# EAGLE design Main board (EAGLE 9.6.2)

## Sheet 1 of 4
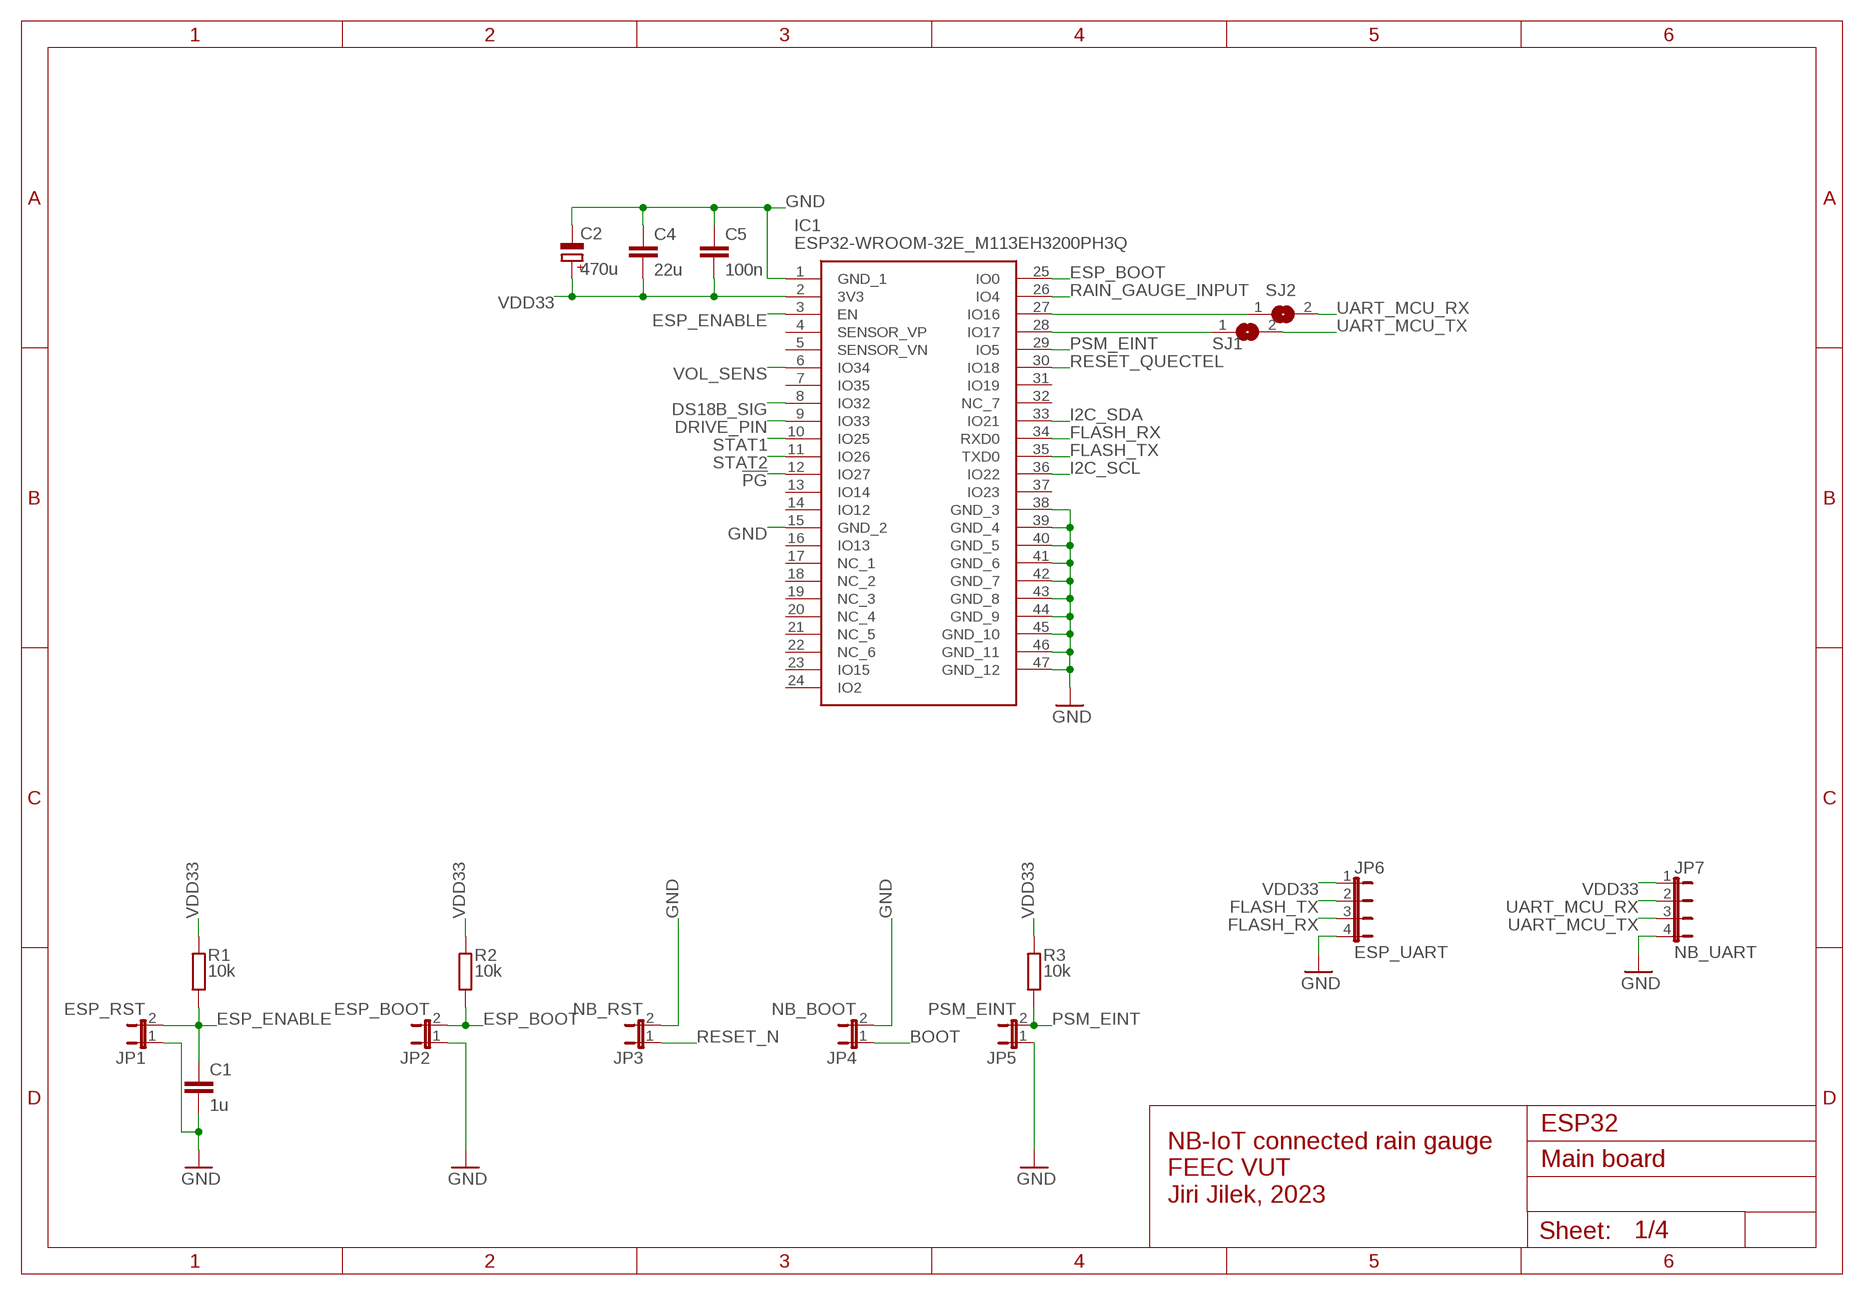
[diagram p0: schematic, sheet 1]

### Parts
C1  1u  C-EUC0603  [C0603]
C2  470u  CPOL-EUD  [PANASONIC_D]
C4  22u  C-EUC0603  [C0603]
C5  100n  C-EUC0603  [C0603]
IC1  ESP32-WROOM-32E_M113EH3200PH3Q  [ESP32WROOM32EM113EH3200PH3Q0]
JP1  ESP_RST  JP1E  [JP1]
JP2  ESP_BOOT  JP1E  [JP1]
JP3  NB_RST  JP1E  [JP1]
JP4  NB_BOOT  JP1E  [JP1]
JP5  PSM_EINT  JP1E  [JP1]
JP6  ESP_UART  JP4E  [JP4]
JP7  NB_UART  JP4E  [JP4]
R1  10k  R-EU_R0603  [R0603]
R2  10k  R-EU_R0603  [R0603]
R3  10k  R-EU_R0603  [R0603]
SJ1  SJ  [SJ]
SJ2  SJ  [SJ]

### Nets
!PG: IC1.12(IO27) ; also sheet 3
BOOT: JP4.1 ; also sheet 2
DRIVE_PIN: IC1.9(IO33) ; also sheet 4
DS18B_SIG: IC1.8(IO32) ; also sheet 4
ESP_BOOT: IC1.25(IO0) JP2.2 R2.1
ESP_ENABLE: C1.1 IC1.3(EN) JP1.2 R1.1
FLASH_RX: IC1.34(RXD0) JP6.3
FLASH_TX: IC1.35(TXD0) JP6.2
GND: C1.2 C2.- C4.1 C5.1 IC1.1(GND_1) IC1.15(GND_2) IC1.38(GND_3) IC1.39(GND_4) IC1.40(GND_5) IC1.41(GND_6) IC1.42(GND_7) IC1.43(GND_8) IC1.44(GND_9) IC1.45(GND_10) IC1.46(GND_11) IC1.47(GND_12) JP1.1 JP2.1 JP3.2 JP4.2 JP5.1 JP6.4 JP7.4 ; also sheet 2,3,4
I2C_SCL: IC1.36(IO22) ; also sheet 4
I2C_SDA: IC1.33(IO21) ; also sheet 4
N$3: IC1.27(IO16) SJ2.1
N$4: IC1.28(IO17) SJ1.1
PSM_EINT: IC1.29(IO5) JP5.2 R3.1 ; also sheet 2
RAIN_GAUGE_INPUT: IC1.26(IO4) ; also sheet 4
RESET_N: JP3.1 ; also sheet 2
RESET_QUECTEL: IC1.30(IO18) ; also sheet 2
STAT1: IC1.10(IO25) ; also sheet 3
STAT2: IC1.11(IO26) ; also sheet 3
UART_MCU_RX: JP7.2 SJ2.2 ; also sheet 2
UART_MCU_TX: JP7.3 SJ1.2 ; also sheet 2
VDD33: C2.+ C4.2 C5.2 IC1.2(3V3) JP6.1 JP7.1 R1.2 R2.2 R3.2 ; also sheet 2,3,4
VOL_SENS: IC1.6(IO34) ; also sheet 4
Unconnected: IC1.4(SENSOR_VP) IC1.5(SENSOR_VN) IC1.7(IO35) IC1.13(IO14) IC1.14(IO12) IC1.16(IO13) IC1.17(NC_1) IC1.18(NC_2) IC1.19(NC_3) IC1.20(NC_4) IC1.21(NC_5) IC1.22(NC_6) IC1.23(IO15) IC1.24(IO2) IC1.31(IO19) IC1.32(NC_7) IC1.37(IO23)

### Notes on the sheet
- NB-IoT connected rain gauge
  FEEC VUT
  Jiri Jilek, 2023
- ESP32

## Sheet 2 of 4
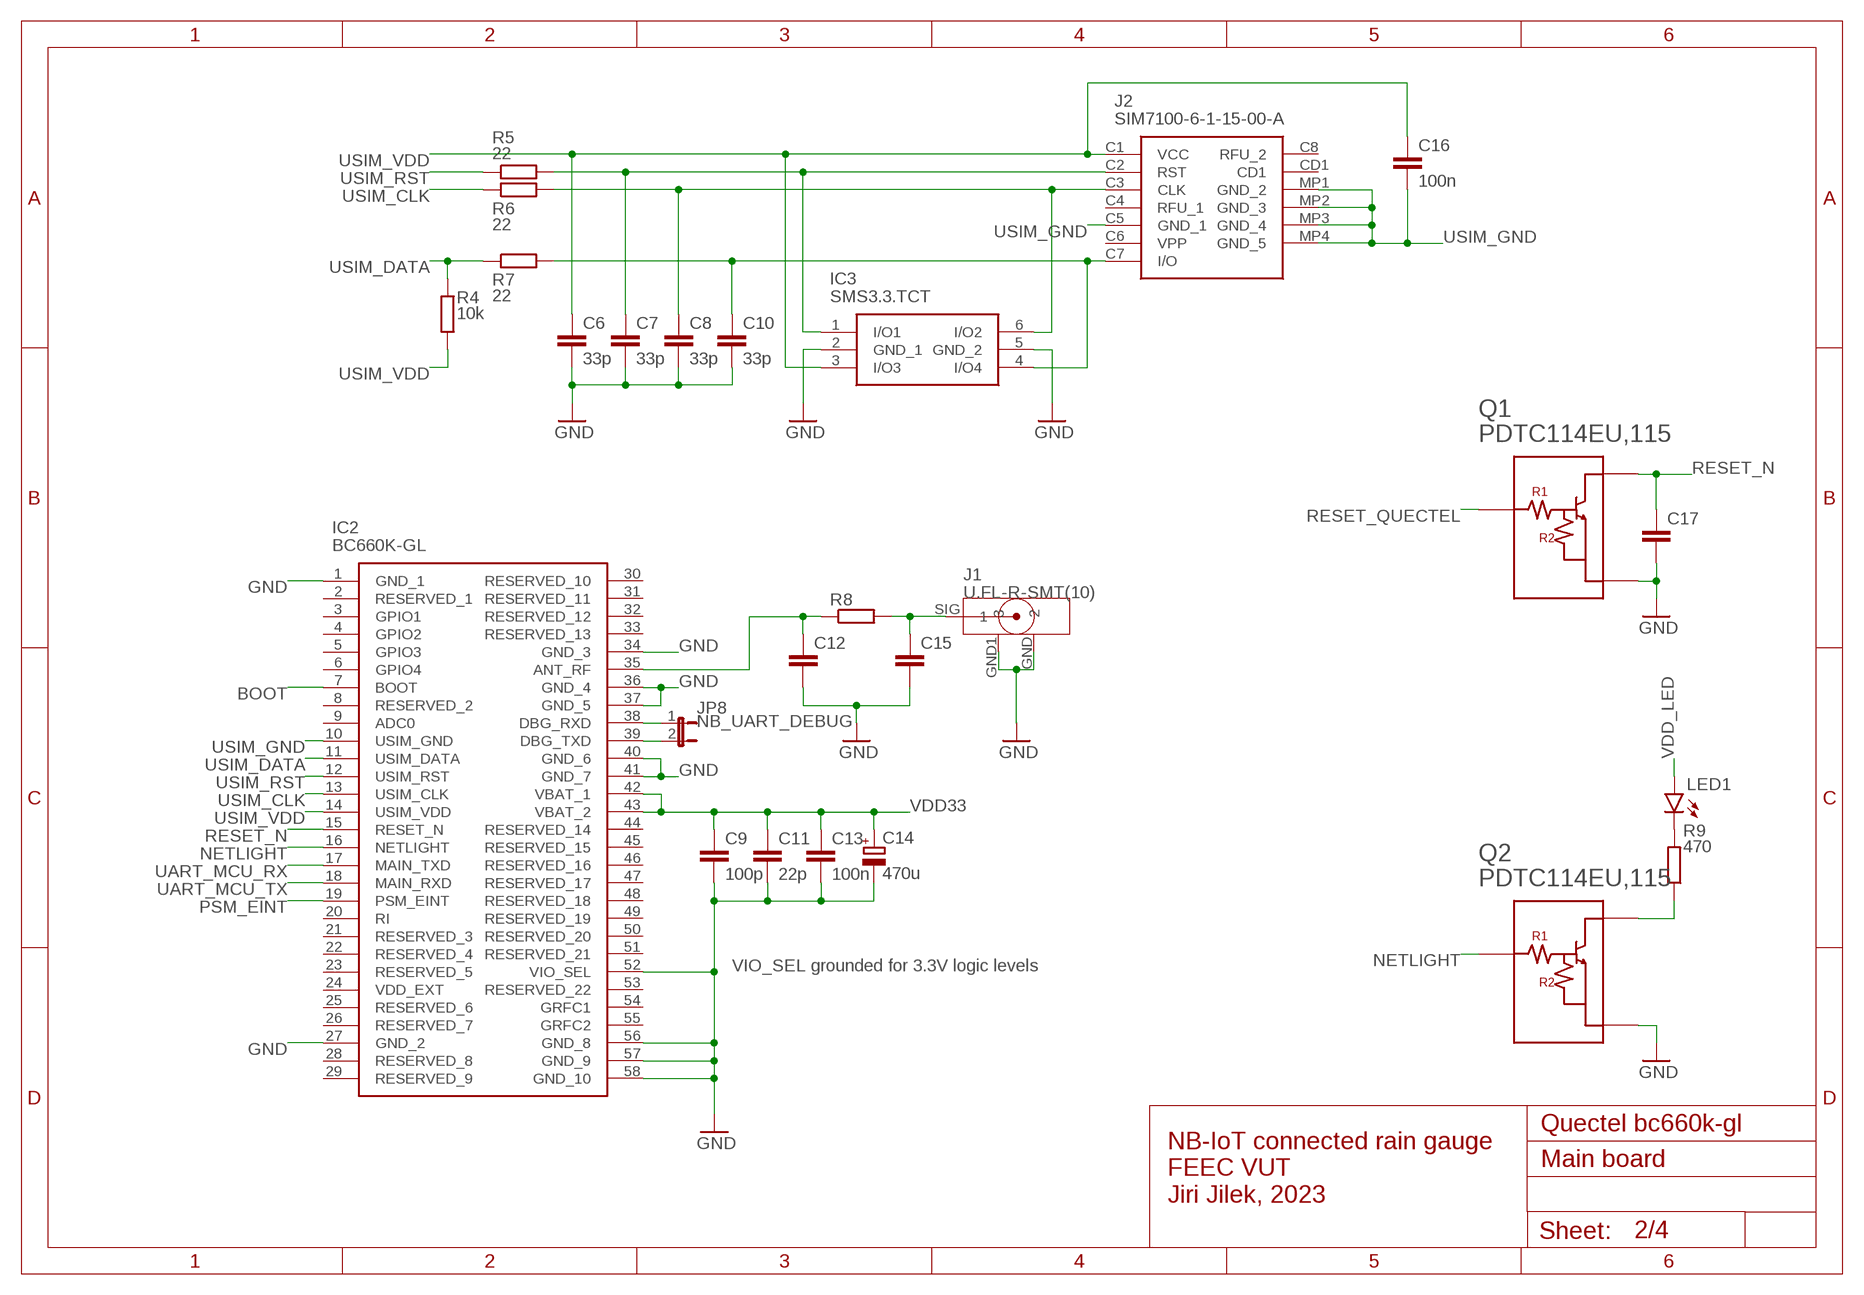
[diagram p1: schematic, sheet 2]

### Parts
C6  33p  C-EUC0603  [C0603]
C7  33p  C-EUC0603  [C0603]
C8  33p  C-EUC0603  [C0603]
C9  100p  C-EUC0603  [C0603]
C10  33p  C-EUC0603  [C0603]
C11  22p  C-EUC0603  [C0603]
C12  C-EUC0603  [C0603]
C13  100n  C-EUC0603  [C0603]
C14  470u  CPOL-EUD  [PANASONIC_D]
C15  C-EUC0603  [C0603]
C16  100n  C-EUC0603  [C0603]
C17  C-EUC0603  [C0603]
IC2  BC660K-GL  [BC660KGL]
IC3  SMS3.3.TCT  [SOT95P280X145-6N]
J1  U.FL-R-SMT(10)  [U.FL-R-SMT(10)]
J2  SIM7100-6-1-15-00-A  [SIM7100611500A]
JP8  NB_UART_DEBUG  JP1E  [JP1]
LED1  NETSTAT  LEDCHIPLED_0805  [CHIPLED_0805]
Q1  PDTC114EU,115  [SOT65P210X110-3N]
Q2  PDTC114EU,115  [SOT65P210X110-3N]
R4  10k  R-EU_R0603  [R0603]
R5  22  R-EU_R0603  [R0603]
R6  22  R-EU_R0603  [R0603]
R7  22  R-EU_R0603  [R0603]
R8  R-EU_R0603  [R0603]
R9  470  R-EU_R0603  [R0603]

### Nets
BOOT: IC2.7(BOOT) ; also sheet 1
GND: C6.2 C7.2 C8.2 C9.2 C10.2 C11.2 C12.2 C13.2 C14.- C15.2 C17.2 IC2.1(GND_1) IC2.27(GND_2) IC2.34(GND_3) IC2.36(GND_4) IC2.37(GND_5) IC2.40(GND_6) IC2.41(GND_7) IC2.52(VIO_SEL) IC2.56(GND_8) IC2.57(GND_9) IC2.58(GND_10) IC3.2(GND_1) IC3.5(GND_2) J1.GND J1.GND1 Q1.2(GND) Q2.2(GND) ; also sheet 1,3,4
N$1: IC2.38(DBG_RXD) JP8.1
N$2: IC2.39(DBG_TXD) JP8.2
N$16: LED1.C R9.2
N$17: Q2.3(OUTPUT) R9.1
N$19: C12.1 IC2.35(ANT_RF) R8.1
N$20: C15.1 J1.SIG R8.2
N$21: C7.1 IC3.1(I/O1) J2.C2(RST) R5.2
N$22: C8.1 IC3.6(I/O2) J2.C3(CLK) R6.2
N$23: C10.1 IC3.4(I/O4) J2.C7(I/O) R7.2
NETLIGHT: IC2.16(NETLIGHT) Q2.1(INPUT)
PSM_EINT: IC2.19(PSM_EINT) ; also sheet 1
RESET_N: C17.1 IC2.15(RESET_N) Q1.3(OUTPUT) ; also sheet 1
RESET_QUECTEL: Q1.1(INPUT) ; also sheet 1
UART_MCU_RX: IC2.17(MAIN_TXD) ; also sheet 1
UART_MCU_TX: IC2.18(MAIN_RXD) ; also sheet 1
USIM_CLK: IC2.13(USIM_CLK) R6.1
USIM_DATA: IC2.11(USIM_DATA) R4.2 R7.1
USIM_GND: C16.2 IC2.10(USIM_GND) J2.C5(GND_1) J2.MP1(GND_2) J2.MP2(GND_3) J2.MP3(GND_4) J2.MP4(GND_5)
USIM_RST: IC2.12(USIM_RST) R5.1
USIM_VDD: C6.1 C16.1 IC2.14(USIM_VDD) IC3.3(I/O3) J2.C1(VCC) R4.1
VDD33: C9.1 C11.1 C13.1 C14.+ IC2.42(VBAT_1) IC2.43(VBAT_2) ; also sheet 1,3,4
VDD_LED: LED1.A ; also sheet 3
Unconnected: IC2.2(RESERVED_1) IC2.3(GPIO1) IC2.4(GPIO2) IC2.5(GPIO3) IC2.6(GPIO4) IC2.8(RESERVED_2) IC2.9(ADC0) IC2.20(RI) IC2.21(RESERVED_3) IC2.22(RESERVED_4) IC2.23(RESERVED_5) IC2.24(VDD_EXT) IC2.25(RESERVED_6) IC2.26(RESERVED_7) IC2.28(RESERVED_8) IC2.29(RESERVED_9) IC2.30(RESERVED_10) IC2.31(RESERVED_11) IC2.32(RESERVED_12) IC2.33(RESERVED_13) IC2.44(RESERVED_14) IC2.45(RESERVED_15) IC2.46(RESERVED_16) IC2.47(RESERVED_17) IC2.48(RESERVED_18) IC2.49(RESERVED_19) IC2.50(RESERVED_20) IC2.51(RESERVED_21) IC2.53(RESERVED_22) IC2.54(GRFC1) IC2.55(GRFC2) J2.C4(RFU_1) J2.C6(VPP) J2.C8(RFU_2) J2.CD1

### Notes on the sheet
- VIO_SEL grounded for 3.3V logic levels
- NB-IoT connected rain gauge
  FEEC VUT
  Jiri Jilek, 2023
- Quectel bc660k-gl

## Sheet 3 of 4
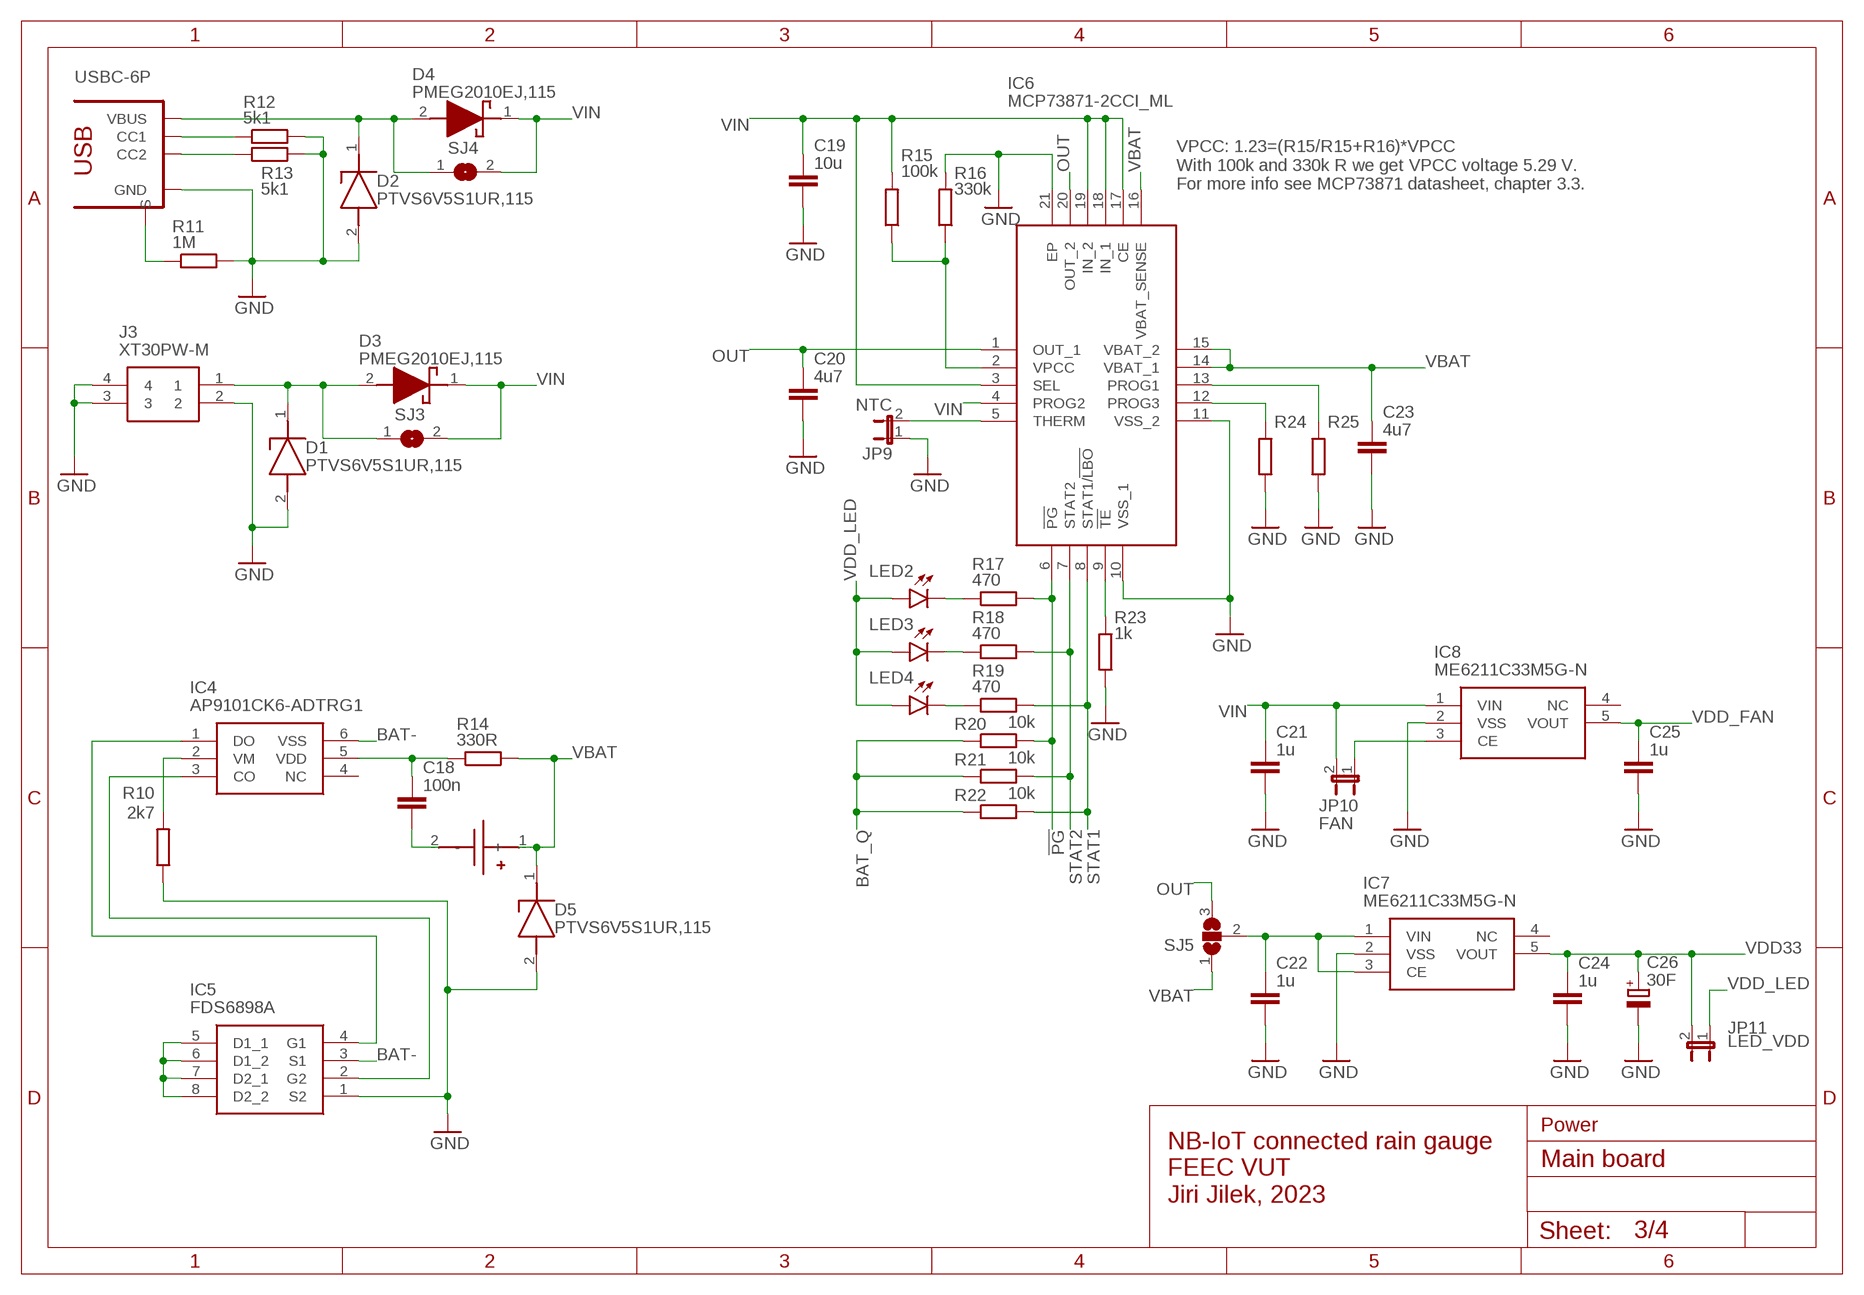
[diagram p2: schematic, sheet 3]

### Parts
$3_29_$_2023-03-21_17-43-41  USBC-6P  [USCX-06FX-XXMX-01]
$3_30_$_2023-03-21_17-43-41  BLOSSOM-BLM-18650-1PCS  [BLOSSOM-BLM-18650-1PCS]
C18  100n  C-EUC0603  [C0603]
C19  10u  C-EUC0603  [C0603]
C20  4u7  C-EUC0603  [C0603]
C21  1u  C-EUC0603  [C0603]
C22  1u  C-EUC0603  [C0603]
C23  4u7  C-EUC0603  [C0603]
C24  1u  C-EUC0603  [C0603]
C25  1u  C-EUC0603  [C0603]
C26  30F  CPOL-EUE5-10.5  [E5-10,5]
D1  PTVS6V5S1UR,115  [SOD123W]
D2  PTVS6V5S1UR,115  [SOD123W]
D3  PMEG2010EJ,115  [SODFL2512X80N]
D4  PMEG2010EJ,115  [SODFL2512X80N]
D5  PTVS6V5S1UR,115  [SOD123W]
IC4  AP9101CK6-ADTRG1  [SOT95P285X140-6N]
IC5  FDS6898A  [SOIC127P600X175-8N]
IC6  MCP73871-2CCI_ML  [QFN50P400X400X100-21N]
IC7  ME6211C33M5G-N  [SOT95P270X145-5N]
IC8  ME6211C33M5G-N  [SOT95P270X145-5N]
J3  XT30PW-M  [XT30PWM]
JP9  NTC  JP1E  [JP1]
JP10  FAN  JP1E  [JP1]
JP11  LED_VDD  JP1E  [JP1]
LED2  !PG  LEDCHIPLED_0805  [CHIPLED_0805]
LED3  STAT2  LEDCHIPLED_0805  [CHIPLED_0805]
LED4  STAT1  LEDCHIPLED_0805  [CHIPLED_0805]
R10  2k7  R-EU_R0805  [R0805]
R11  1M  R-EU_R0603  [R0603]
R12  5k1  R-EU_R0603  [R0603]
R13  5k1  R-EU_R0603  [R0603]
R14  330R  R-EU_R0603  [R0603]
R15  100k  R-EU_R0805  [R0805]
R16  330k  R-EU_R0805  [R0805]
R17  470  R-EU_R0603  [R0603]
R18  470  R-EU_R0603  [R0603]
R19  470  R-EU_R0603  [R0603]
R20  10k  R-EU_R0603  [R0603]
R21  10k  R-EU_R0603  [R0603]
R22  10k  R-EU_R0603  [R0603]
R23  1k  R-EU_R0603  [R0603]
R24  R-EU_R0805  [R0805]
R25  R-EU_R0805  [R0805]
SJ3  SJ  [SJ]
SJ4  SJ  [SJ]
SJ5  SJ2W  [SJ_2]

### Nets
!PG: IC6.6(!PG) R17.2 R20.2 ; also sheet 1
!TE1: IC6.9(!TE) R23.1
BAT-: $3_30_$_2023-03-21_17-43-41.2(-) C18.2 IC4.6(VSS) IC5.3(S1)
BAT_Q: R20.1 R21.1 R22.1 ; also sheet 4
CC3: $3_29_$_2023-03-21_17-43-41.CC2 R13.1
CC4: $3_29_$_2023-03-21_17-43-41.CC1 R12.1
DRAIN1: IC5.5(D1_1) IC5.6(D1_2) IC5.7(D2_1) IC5.8(D2_2)
G3: IC4.1(DO) IC5.4(G1)
G4: IC4.3(CO) IC5.2(G2)
GND: $3_29_$_2023-03-21_17-43-41.GND1(GND) $3_29_$_2023-03-21_17-43-41.GND2(GND) C19.2 C20.2 C21.2 C22.2 C23.2 C24.2 C25.2 C26.- D1.2(A) D2.2(A) D5.2(A) IC5.1(S2) IC6.10(VSS_1) IC6.11(VSS_2) IC6.21(EP) IC7.2(VSS) IC8.2(VSS) J3.2 J3.3 J3.4 JP9.1 R10.1 R11.2 R12.2 R13.2 R16.2 R23.2 R24.2 R25.2 ; also sheet 1,2,4
N$5: C18.1 IC4.5(VDD) R14.1
N$6: IC8.3(CE) JP10.1
N$7: LED2.C R17.1
N$8: LED3.C R18.1
N$9: LED4.C R19.1
OUT: C20.1 IC6.1(OUT_1) IC6.20(OUT_2) SJ5.3
PROG1: IC6.13(PROG1) R25.1
PROG3: IC6.12(PROG3) R24.1
PV_IN1: D1.1(K) D3.2(A) J3.1 SJ3.1
S1: $3_29_$_2023-03-21_17-43-41.SHIELD1(S) $3_29_$_2023-03-21_17-43-41.SHIELD2(S) $3_29_$_2023-03-21_17-43-41.SHIELD3(S) $3_29_$_2023-03-21_17-43-41.SHIELD4(S) R11.1
STAT1: IC6.8(STAT1/!LBO) R19.2 R22.2 ; also sheet 1
STAT2: IC6.7(STAT2) R18.2 R21.2 ; also sheet 1
THERM1: IC6.5(THERM) JP9.2
VBAT: $3_30_$_2023-03-21_17-43-41.1(+) C23.1 D5.1(K) IC6.14(VBAT_1) IC6.15(VBAT_2) IC6.16(VBAT_SENSE) R14.2 SJ5.1 ; also sheet 4
VBUS1: $3_29_$_2023-03-21_17-43-41.VBUS1(VBUS) $3_29_$_2023-03-21_17-43-41.VBUS2(VBUS) D2.1(K) D4.2(A) SJ4.1
VDD33: C24.1 C26.+ IC7.5(VOUT) JP11.2 ; also sheet 1,2,4
VDD_FAN: C25.1 IC8.5(VOUT) ; also sheet 4
VDD_LED: JP11.1 LED2.A LED3.A LED4.A ; also sheet 2
VIN: C19.1 C21.1 D3.1(K) D4.1(K) IC6.3(SEL) IC6.4(PROG2) IC6.17(CE) IC6.18(IN_1) IC6.19(IN_2) IC8.1(VIN) JP10.2 R15.2 SJ3.2 SJ4.2
VIN_LDO: C22.1 IC7.1(VIN) IC7.3(CE) SJ5.2
VM1: IC4.2(VM) R10.2
VPCC1: IC6.2(VPCC) R15.1 R16.1
Unconnected: IC4.4(NC) IC7.4(NC) IC8.4(NC)

### Notes on the sheet
- VPCC: 1.23=(R15/R15+R16)*VPCC
  With 100k and 330k R we get VPCC voltage 5.29 V.
  For more info see MCP73871 datasheet, chapter 3.3.
- NB-IoT connected rain gauge
  FEEC VUT
  Jiri Jilek, 2023
- Power

## Sheet 4 of 4: Connectors
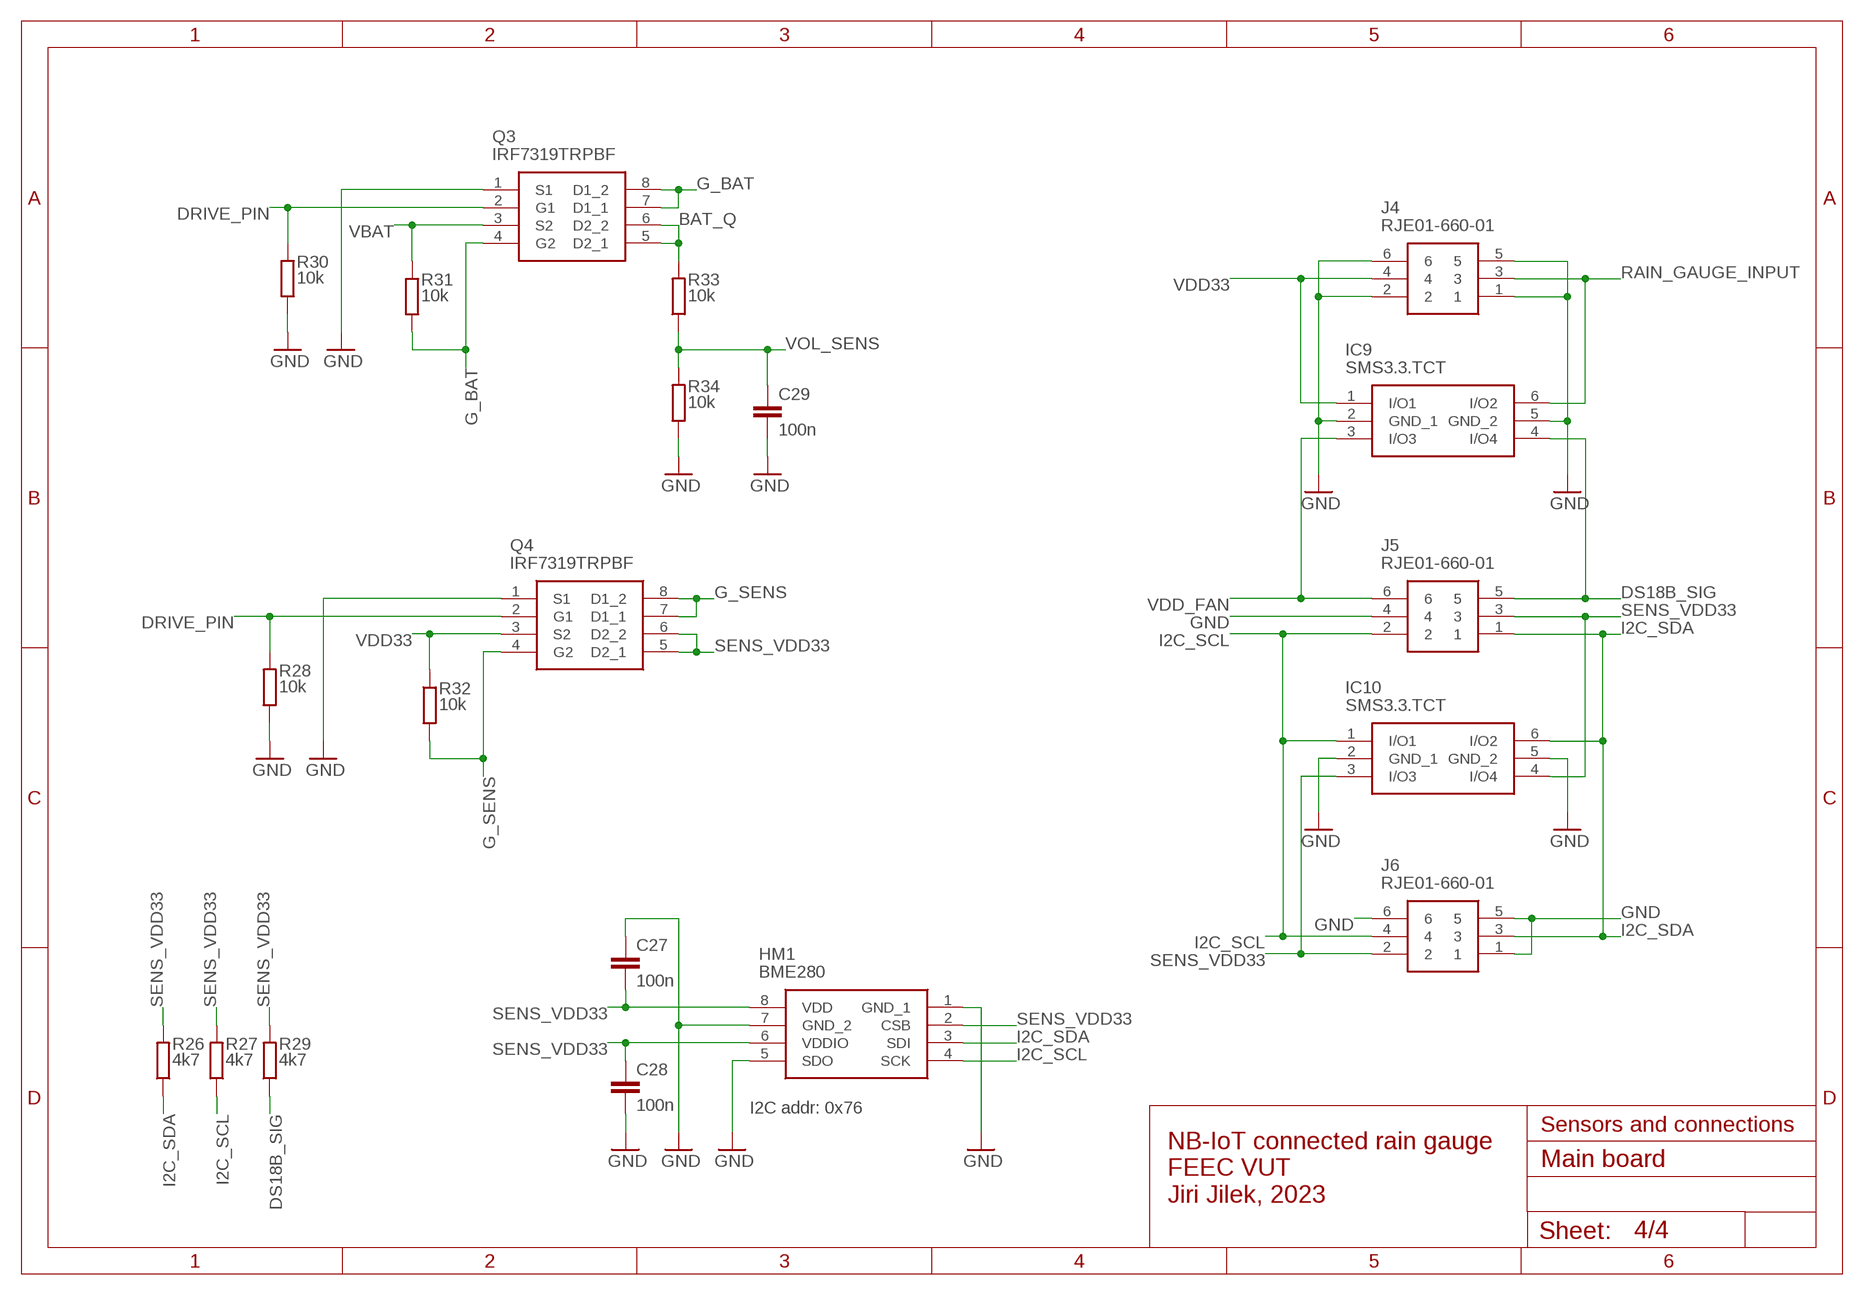
[diagram p3: schematic, sheet 4]

### Parts
C27  100n  C-EUC0805  [C0805]
C28  100n  C-EUC0805  [C0805]
C29  100n  C-EUC0805  [C0805]
HM1  BME280  [BME280]
IC9  SMS3.3.TCT  [SOT95P280X145-6N]
IC10  SMS3.3.TCT  [SOT95P280X145-6N]
J4  RJE01-660-01  [RJE0166001]
J5  RJE01-660-01  [RJE0166001]
J6  RJE01-660-01  [RJE0166001]
Q3  IRF7319TRPBF  [SOIC127P600X175-8N]
Q4  IRF7319TRPBF  [SOIC127P600X175-8N]
R26  4k7  R-EU_R0805  [R0805]
R27  4k7  R-EU_R0805  [R0805]
R28  10k  R-EU_R0805  [R0805]
R29  4k7  R-EU_R0805  [R0805]
R30  10k  R-EU_R0805  [R0805]
R31  10k  R-EU_R0805  [R0805]
R32  10k  R-EU_R0805  [R0805]
R33  10k  R-EU_R0805  [R0805]
R34  10k  R-EU_R0805  [R0805]

### Nets
BAT_Q: Q3.5(D2_1) Q3.6(D2_2) R33.2 ; also sheet 3
DRIVE_PIN: Q3.2(G1) Q4.2(G1) R28.2 R30.2 ; also sheet 1
DS18B_SIG: IC9.4(I/O4) J5.5 R29.1 ; also sheet 1
G_BAT: Q3.4(G2) Q3.7(D1_1) Q3.8(D1_2) R31.2
G_SENS: Q4.4(G2) Q4.7(D1_1) Q4.8(D1_2) R32.2
GND: C27.1 C28.2 C29.2 HM1.1(GND_1) HM1.5(SDO) HM1.7(GND_2) IC9.2(GND_1) IC9.5(GND_2) IC10.2(GND_1) IC10.5(GND_2) J4.1 J4.2 J4.5 J4.6 J5.4 J6.1 J6.5 J6.6 Q3.1(S1) Q4.1(S1) R28.1 R30.1 R34.1 ; also sheet 1,2,3
I2C_SCL: HM1.4(SCK) IC10.1(I/O1) J5.2 J6.4 R27.1 ; also sheet 1
I2C_SDA: HM1.3(SDI) IC10.6(I/O2) J5.1 J6.3 R26.1 ; also sheet 1
RAIN_GAUGE_INPUT: IC9.6(I/O2) J4.3 ; also sheet 1
SENS_VDD33: C27.2 C28.1 HM1.2(CSB) HM1.6(VDDIO) HM1.8(VDD) IC10.3(I/O3) IC10.4(I/O4) J5.3 J6.2 Q4.5(D2_1) Q4.6(D2_2) R26.2 R27.2 R29.2
VBAT: Q3.3(S2) R31.1 ; also sheet 3
VDD33: IC9.1(I/O1) J4.4 Q4.3(S2) R32.1 ; also sheet 1,2,3
VDD_FAN: IC9.3(I/O3) J5.6 ; also sheet 3
VOL_SENS: C29.1 R33.1 R34.2 ; also sheet 1

### Notes on the sheet
- I2C addr: 0x76
- NB-IoT connected rain gauge
  FEEC VUT
  Jiri Jilek, 2023
- Sensors and connections

## Library data of the parts
$3_29_$_2023-03-21_17-43-41 = USBC6P:USBC-6P: AliExpress Special! Connect 5.1k 10% resistors to each CC pin, pulled up to 3.3v or 5.0v.
$3_30_$_2023-03-21_17-43-41 = battery-holders:BLOSSOM-BLM-18650-1PCS
C1 C4-C13 C15-C25 C27-C29 = rcl:C-EU: CAPACITOR, European symbol; SPICEPREFIX: C
C2 C14 C26 = rcl:CPOL-EU: POLARIZED CAPACITOR, European symbol; SPICEPREFIX: C
D1 D2 D5 = 1-component-search:PTVS6V5S1UR,115: PTVSxS1UR series - 400 W Transient Voltage Suppressor Source: Datasheet <https://assets.nexperia.com/documents/data-sheet/PTVSXS1UR_SER.pdf>; ARROW_PART_NUMBER: PTVS6V5S1UR,115; ARROW_PRICE-STOCK: https://www.arrow.com/en/products/ptvs6v5s1ur115/nexperia?region=nac; DESCRIPTION: PTVSxS1UR series - 400 W Transient Voltage Suppressor; HEIGHT: mm; MANUFACTURER_NAME: Nexperia; MANUFACTURER_PART_NUMBER: PTVS6V5S1UR,115; MOUSER_PART_NUMBER: 771-PTVS6V5S1UR115; MOUSER_PRICE-STOCK: https://www.mouser.co.uk/ProductDetail/Nexperia/PTVS6V5S1UR115?qs=LMSg3oBIm%2FgAohhVsgR2gg%3D%3D
D3 D4 = 1-component-search:PMEG2010EJ,115: Schottky Diodes & Rectifiers SCHOTTKY 20V 1A Source: Datasheet <https://assets.nexperia.com/documents/data-sheet/PMEG2010EH_EJ_ET.pdf>; ARROW_PART_NUMBER: PMEG2010EJ,115; ARROW_PRICE-STOCK: https://www.arrow.com/en/products/pmeg2010ej115/nexperia?region=nac; DESCRIPTION: Schottky Diodes & Rectifiers SCHOTTKY 20V 1A; HEIGHT: 0.8mm; MANUFACTURER_NAME: Nexperia; MANUFACTURER_PART_NUMBER: PMEG2010EJ,115; MOUSER_PART_NUMBER: 771-PMEG2010EJ-T/R; MOUSER_PRICE-STOCK: https://www.mouser.co.uk/ProductDetail/Nexperia/PMEG2010EJ115?qs=LOCUfHb8d9umE8j0ERLykg%3D%3D
HM1 = 1-component-search:BME280: Board Mount Humidity Sensors Source: Datasheet <https://datasheet.datasheetarchive.com/originals/distributors/DKDS-24/462906.pdf>; ARROW_PART_NUMBER: BME280; ARROW_PRICE-STOCK: https://www.arrow.com/en/products/bme280/bosch?region=nac; DESCRIPTION: Board Mount Humidity Sensors; HEIGHT: mm; MANUFACTURER_NAME: BOSCH; MANUFACTURER_PART_NUMBER: BME280; MOUSER_PART_NUMBER: 262-BME280; MOUSER_PRICE-STOCK: https://www.mouser.co.uk/ProductDetail/Bosch-Sensortec/BME280?qs=2OnyuXx6vpj2fK9HX7qb3g%3D%3D
IC1 = 1-component-search:ESP32-WROOM-32E_M113EH3200PH3Q: WiFi Modules (802.11) SMD Module ESP32-D0WD-V3, 4 MB SPI flash, PCB antenna Source: Datasheet <https://www.mouser.com/datasheet/2/891/esp32-wroom-32e_esp32-wroom-32ue_datasheet_en-1855879.pdf>; DESCRIPTION: WiFi Modules (802.11) SMD Module ESP32-D0WD-V3, 4 MB SPI flash, PCB antenna; HEIGHT: 3.25mm; MANUFACTURER_NAME: Espressif Systems; MANUFACTURER_PART_NUMBER: ESP32-WROOM-32E(M113EH3200PH3Q0); MOUSER_PART_NUMBER: 356-ESP32WRM32E132PH; MOUSER_PRICE-STOCK: https://www.mouser.co.uk/ProductDetail/Espressif-Systems/ESP32-WROOM-32EM113EH3200PH3Q0?qs=vHuUswq2%252Bsx8Xcp7bzmaHA%3D%3D
IC2 = 1-component-search:BC660K-GL: Compact NB-IoT Module with Ultra-low Power Consumption LTE Cat NB2 2.2V to 4.3V 16.7kbps/158.5kbps 58-Pin LCC - Tape and Reel Source: Datasheet <https://www.quectel.com/wp-content/uploads/2021/04/Quectel_BC660K-GL_Hardware_Design_V1.0.pdf>; DESCRIPTION: Compact NB-IoT Module with Ultra-low Power Consumption LTE Cat NB2 2.2V to 4.3V 16.7kbps/158.5kbps 58-Pin LCC - Tape and Reel; HEIGHT: 2.2mm; MANUFACTURER_NAME: Quectel; MANUFACTURER_PART_NUMBER: BC660K-GL
IC3 IC9 IC10 = 1-component-search:SMS3.3.TCT: ESD Suppressors 300W TVS 3.3 V 7"RL Source: Datasheet <https://datasheet.datasheetarchive.com/originals/distributors/DKDS-37/728695.pdf>; ARROW_PART_NUMBER: SMS3.3.TCT; ARROW_PRICE-STOCK: https://www.arrow.com/en/products/sms3.3.tct/semtech?region=nac; DESCRIPTION: ESD Suppressors 300W TVS 3.3 V 7"RL; HEIGHT: 1.45mm; MANUFACTURER_NAME: SEMTECH; MANUFACTURER_PART_NUMBER: SMS3.3.TCT; MOUSER_PART_NUMBER: 947-SMS3.3.TCT; MOUSER_PRICE-STOCK: https://www.mouser.co.uk/ProductDetail/Semtech/SMS3.3.TCT?qs=rBWM4%252BvDhIcIJ2ejWoXlKQ%3D%3D
IC4 = 1-component-search:AP9101CK6-ADTRG1: Battery Management Protect w/ Pwr Down 1-Cell LI 3.0uA 3.5V Source: Datasheet <https://www.diodes.com/assets/Datasheets/AP9101C.pdf>; ARROW_PART_NUMBER: AP9101CK6-ADTRG1; ARROW_PRICE-STOCK: https://www.arrow.com/en/products/ap9101ck6-adtrg1/diodes-incorporated?region=nac; DESCRIPTION: Battery Management Protect w/ Pwr Down 1-Cell LI 3.0uA 3.5V; HEIGHT: 1.4mm; MANUFACTURER_NAME: Diodes Inc.; MANUFACTURER_PART_NUMBER: AP9101CK6-ADTRG1; MOUSER_PART_NUMBER: 621-AP9101CK6-ADTRG1; MOUSER_PRICE-STOCK: https://www.mouser.co.uk/ProductDetail/Diodes-Incorporated/AP9101CK6-ADTRG1?qs=W66WzN12R3ZRpT78WZD49g%3D%3D
IC5 = 1-component-search:FDS6898A: ON SEMICONDUCTOR - FDS6898A. - MOSFET, DUAL, N, SMD, SO-8 Source: Datasheet <https://www.onsemi.com/pub/Collateral/FDS6898A-D.PDF>; ARROW_PART_NUMBER: FDS6898A; ARROW_PRICE-STOCK: https://www.arrow.com/en/products/fds6898a/on-semiconductor?region=nac; DESCRIPTION: ON SEMICONDUCTOR - FDS6898A. - MOSFET, DUAL, N, SMD, SO-8; HEIGHT: 1.75mm; MANUFACTURER_NAME: onsemi; MANUFACTURER_PART_NUMBER: FDS6898A; MOUSER_PART_NUMBER: 512-FDS6898A; MOUSER_PRICE-STOCK: https://www.mouser.co.uk/ProductDetail/ON-Semiconductor-Fairchild/FDS6898A?qs=rFoKx6q3%2F911Dc6GES2NNA%3D%3D
IC6 = 1-component-search:MCP73871-2CCI_ML: Li-Ion Charger USB/DC 4.2V TE LBO QFN20 Source: Datasheet <https://datasheet.datasheetarchive.com/originals/distributors/Datasheets-DGA15/728881.pdf>; ARROW_PART_NUMBER: MCP73871-2CCI/ML; ARROW_PRICE-STOCK: https://www.arrow.com/en/products/mcp73871-2cciml/microchip-technology?region=europe; DESCRIPTION: Li-Ion Charger USB/DC 4.2V TE LBO QFN20; HEIGHT: 1mm; MANUFACTURER_NAME: Microchip; MANUFACTURER_PART_NUMBER: MCP73871-2CCI/ML; MOUSER_PART_NUMBER: 579-MCP73871-2CCI/ML; MOUSER_PRICE-STOCK: https://www.mouser.co.uk/ProductDetail/Microchip-Technology/MCP73871-2CCI-ML?qs=qXsUupcbpXyQfJ2clznZxw%3D%3D
IC7 IC8 = 1-component-search:ME6211C33M5G-N: Fixed 6V 3.3V 500mA SOT-23-5 Low Dropout Regulators(LDO) RoHS Source: Datasheet <https://datasheet.lcsc.com/szlcsc/1811131510_MICRONE-Nanjing-Micro-One-Elec-ME6211C33M5G-N_C82942.pdf>; DESCRIPTION: Fixed 6V 3.3V 500mA SOT-23-5 Low Dropout Regulators(LDO) RoHS; HEIGHT: 1.45mm; MANUFACTURER_NAME: Microne; MANUFACTURER_PART_NUMBER: ME6211C33M5G-N
J1 = Connectors:U.FL-R-SMT(10): CONN U.FL RCPT STR 50 OHM SMD Manufacturer's datasheet <https://media.digikey.com/pdf/Data%20Sheets/Hirose%20PDFs/UFL%20Series.pdf>; CREATED_BY: PCBLayout.com; DIGIKEY_PART_NUMBER: H9161CT-ND; MANUFACTURER: Hirose Electric Co Ltd; MPN: U.FL-R-SMT(10); PACKAGE: SMD
J2 = 1-component-search:SIM7100-6-1-15-00-A: GCT (GLOBAL CONNECTOR TECHNOLOGY) - SIM7100-6-1-15-00-A - Memory Socket, Push-Push, SIM7100 Series, Micro SIM, 6 Contacts, Phosphor Bronze Source: Datasheet <https://gct.co/files/drawings/sim7100.pdf>; DESCRIPTION: GCT (GLOBAL CONNECTOR TECHNOLOGY) - SIM7100-6-1-15-00-A - Memory Socket, Push-Push, SIM7100 Series, Micro SIM, 6 Contacts, Phosphor Bronze; HEIGHT: 1.5mm; MANUFACTURER_NAME: GCT (GLOBAL CONNECTOR TECHNOLOGY); MANUFACTURER_PART_NUMBER: SIM7100-6-1-15-00-A; MOUSER_PART_NUMBER: 640-SIM7100611500A; MOUSER_PRICE-STOCK: https://www.mouser.co.uk/ProductDetail/GCT/SIM7100-6-1-15-00-A?qs=KUoIvG%2F9IlbCGkqQjwuIBA%3D%3D
J3 = 1-component-search:XT30PW-M: 30A Low Temperature Rise Fire Retardant Plug Source: Datasheet <https://www.tme.eu/sl/Document/ce4077e36b79046da520ca73227e15de/XT30PW SPEC.pdf>; DESCRIPTION: 30A Low Temperature Rise Fire Retardant Plug; HEIGHT: 5mm; MANUFACTURER_NAME: Amass; MANUFACTURER_PART_NUMBER: XT30PW-M
J4-J6 = 1-component-search:RJE01-660-01: Modular Connectors / Ethernet Connectors Mod Jack Cat3 RJ11 Gold Source: Datasheet <https://www.mouser.com/datasheet/2/18/amphenol_RJE016X001-1157271.pdf>; ARROW_PART_NUMBER: RJE01-660-01; ARROW_PRICE-STOCK: https://www.arrow.com/en/products/rje01-660-01/amphenol-fci?region=nac; DESCRIPTION: Modular Connectors / Ethernet Connectors Mod Jack Cat3 RJ11 Gold; HEIGHT: 12.88mm; MANUFACTURER_NAME: Amphenol; MANUFACTURER_PART_NUMBER: RJE01-660-01; MOUSER_PART_NUMBER: 523-RJE01-660-01; MOUSER_PRICE-STOCK: https://www.mouser.co.uk/ProductDetail/Amphenol-Commercial-Products/RJE01-660-01?qs=St27ATL478szj4V93DJo9w%3D%3D
JP1-JP5 JP8-JP11 = jumper:JP1E: JUMPER
JP6 JP7 = jumper:JP4E: JUMPER
LED1-LED4 = led:LED: LED OSRAM: - CHIPLED LG R971, LG N971, LY N971, LG Q971, LY Q971, LO R971, LY R971 LH N974, LH R974 LS Q976, LO Q976, LY Q976 LO Q996 - Hyper CHIPLED LW Q18S LB Q993, LB Q99A, LB R99A - SideLED LS A670, LO A670, LY A670, LG A670, LP A670 LB A673, LV A673, LT A673, LW A673 LH A674 LY A675 LS A676, LA A676, LO A676, LY A676, LW A676 LS A679, LY A679, LG A679 - Hyper Micro SIDELED® LS Y876, LA Y876, LO Y876, LY Y876 LT Y87S - SmartLED LW L88C, LW L88S LB L89C, LB L89S, LG L890 LS L89K, LO L89K, LY L89K LS L896, LA L896, LO L896, LY L896 - TOPLED LS T670, LO T670, LY T670, LG T670, LP T670 LSG T670, LSP T670, LSY T670, LOP T670, LYG T670 LG T671, LOG T671, LSG T671 LB T673, LV T673, LT T673, LW T673 LH T674 LS T676, LA T676, LO T676, LY T676, LB T676, LH T676, LSB T676, LW T676 LB T67C, LV T67C, LT T67C, LS T67K, LO T67K, LY T67K, LW E67C LS E67B, LA E67B, LO E67B, LY E67B, LB E67C, LV E67C, LT E67C LW T67C LS T679, LY T679, LG T679 LS T770, LO T770, LY T770, LG T770, LP T770 LB T773, LV T773, LT T773, LW T773 LH T774 LS E675, LA E675, LY E675, LS T675 LS T776, LA T776, LO T776, LY T776, LB T776 LHGB T686 LT T68C, LB T68C - Hyper Mini TOPLED® LB M676 - Mini TOPLED Santana® LG M470 LS M47K, LO M47K, LY M47K Source: http://www.osram.convergy.de LUXEON: - LUMILED® LXK2-PW12-R00, LXK2-PW12-S00, LXK2-PW14-U00, LXK2-PW14-V00 LXK2-PM12-R00, LXK2-PM12-S00, LXK2-PM14-U00 LXK2-PE12-Q00, LXK2-PE12-R00, LXK2-PE12-S00, LXK2-PE14-T00, LXK2-PE14-U00 LXK2-PB12-K00, LXK2-PB12-L00, LXK2-PB12-M00, LXK2-PB14-N00, LXK2-PB14-P00, LXK2-PB14-Q00 LXK2-PR12-L00, LXK2-PR12-M00, LXK2-PR14-Q00, LXK2-PR14-R00 LXK2-PD12-Q00, LXK2-PD12-R00, LXK2-PD12-S00 LXK2-PH12-R00, LXK2-PH12-S00 LXK2-PL12-P00, LXK2-PL12-Q00, LXK2-PL12-R00 Source: www.luxeon.com KINGBRIGHT: KA-3528ASYC Source: www.kingbright.com
Q1 Q2 = PDTC114EU_115:PDTC114EU,115: PDTC114E series - NPN resistor-equipped transistors; R1 = 10 kΩ, R2 = 10 kΩ Check availability <https://pricing.snapeda.com/parts/PDTC114EU%2C115/Nexperia%20USA%20Inc./view-part?ref=eda>; AVAILABILITY: In Stock; DESCRIPTION: Pre-Biased Bipolar Transistor (BJT) NPN - Pre-Biased 50 V 100 mA 200 mW Surface Mount SOT-323; MF: Nexperia USA Inc.; MP: PDTC114EU,115; PACKAGE: SOT-323 Nexperia USA Inc.; PRICE: None; PURCHASE-URL: https://pricing.snapeda.com/search/part/PDTC114EU,115/?ref=eda
Q3 Q4 = 1-component-search:IRF7319TRPBF: IRF7319TRPBF Dual N/P-Channel MOSFET, 4.9 A, 6.5 A, 30 V HEXFET, 8-Pin SOIC Infineon Source: Datasheet <https://www.infineon.com/dgdl/irf7319pbf.pdf?fileId=5546d462533600a4015355f5c82f1b41>; ARROW_PART_NUMBER: IRF7319TRPBF; ARROW_PRICE-STOCK: https://www.arrow.com/en/products/irf7319trpbf/infineon-technologies-ag?region=nac; DESCRIPTION: IRF7319TRPBF Dual N/P-Channel MOSFET, 4.9 A, 6.5 A, 30 V HEXFET, 8-Pin SOIC Infineon; HEIGHT: 1.75mm; MANUFACTURER_NAME: Infineon; MANUFACTURER_PART_NUMBER: IRF7319TRPBF; MOUSER_PART_NUMBER: 942-IRF7319TRPBF; MOUSER_PRICE-STOCK: https://www.mouser.co.uk/ProductDetail/Infineon-IR/IRF7319TRPBF?qs=9%252BKlkBgLFf3yLUxG6ZIMRA%3D%3D
R1-R34 = rcl:R-EU_: RESISTOR, European symbol; SPICEPREFIX: R
SJ1-SJ4 = jumper:SJ: SMD solder JUMPER
SJ5 = jumper:SJ2W: SMD solder JUMPER

## Module A
Ports: 

### Library data of the parts

## Board
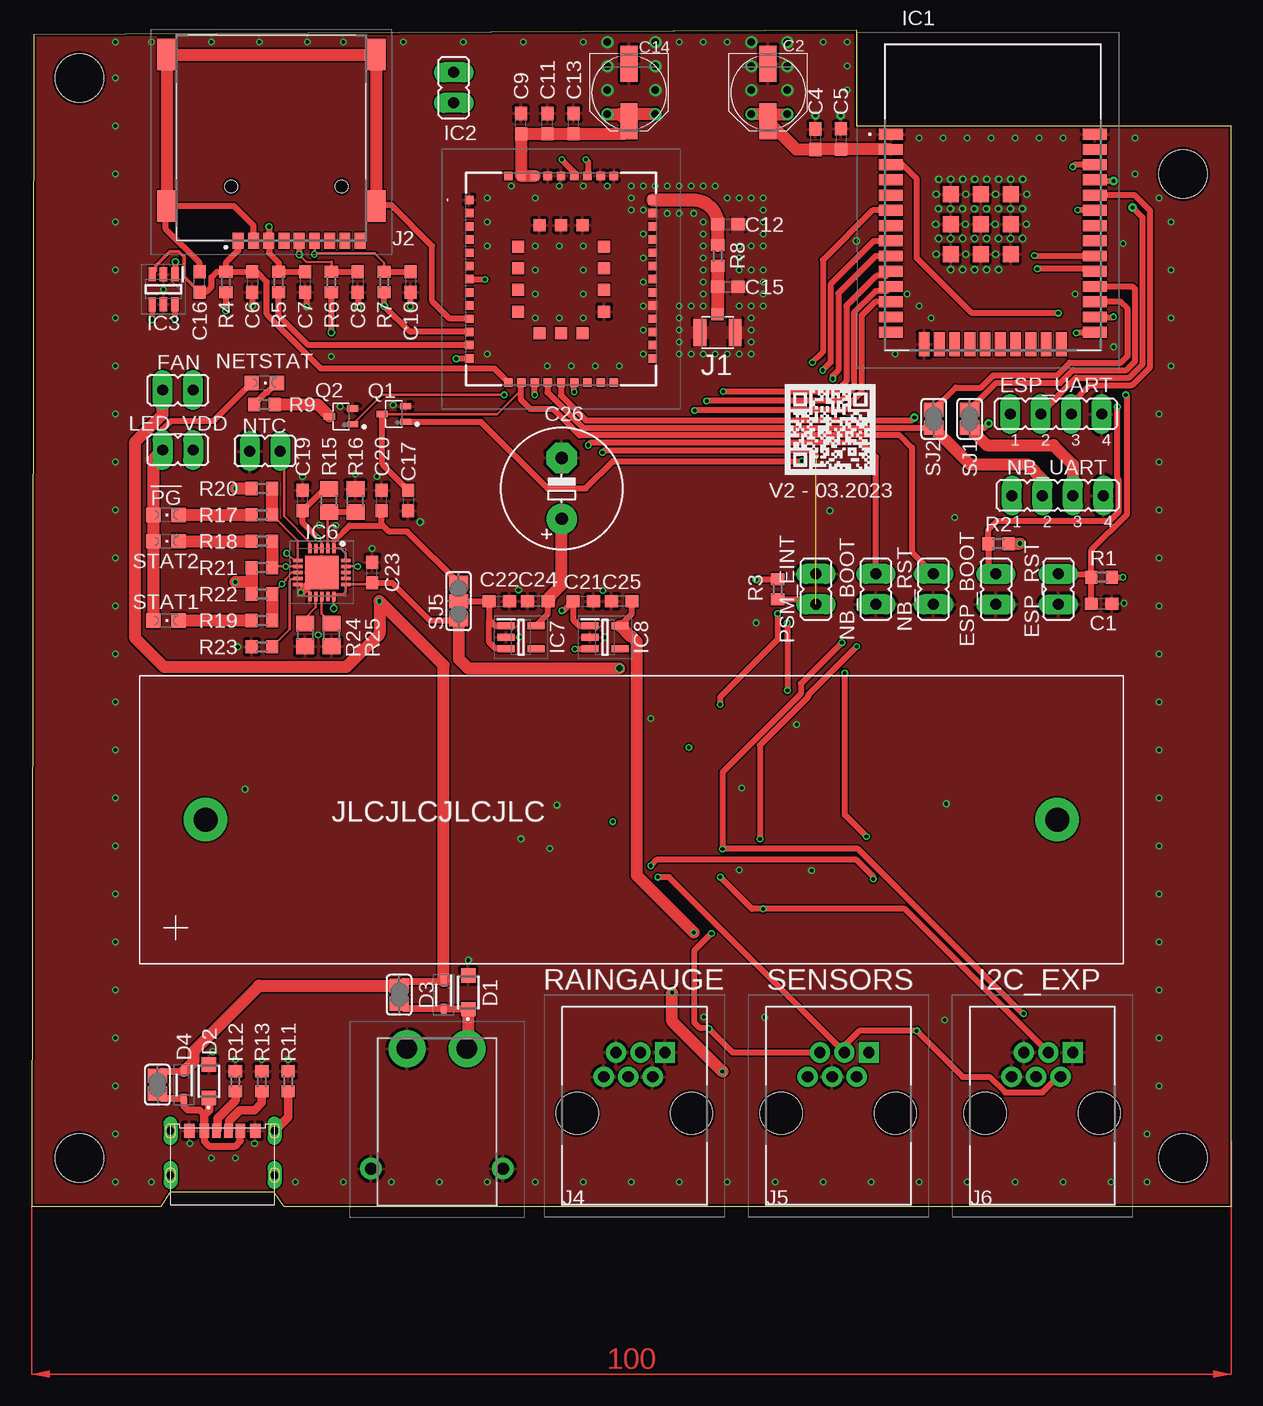
[diagram p4: board, top side]
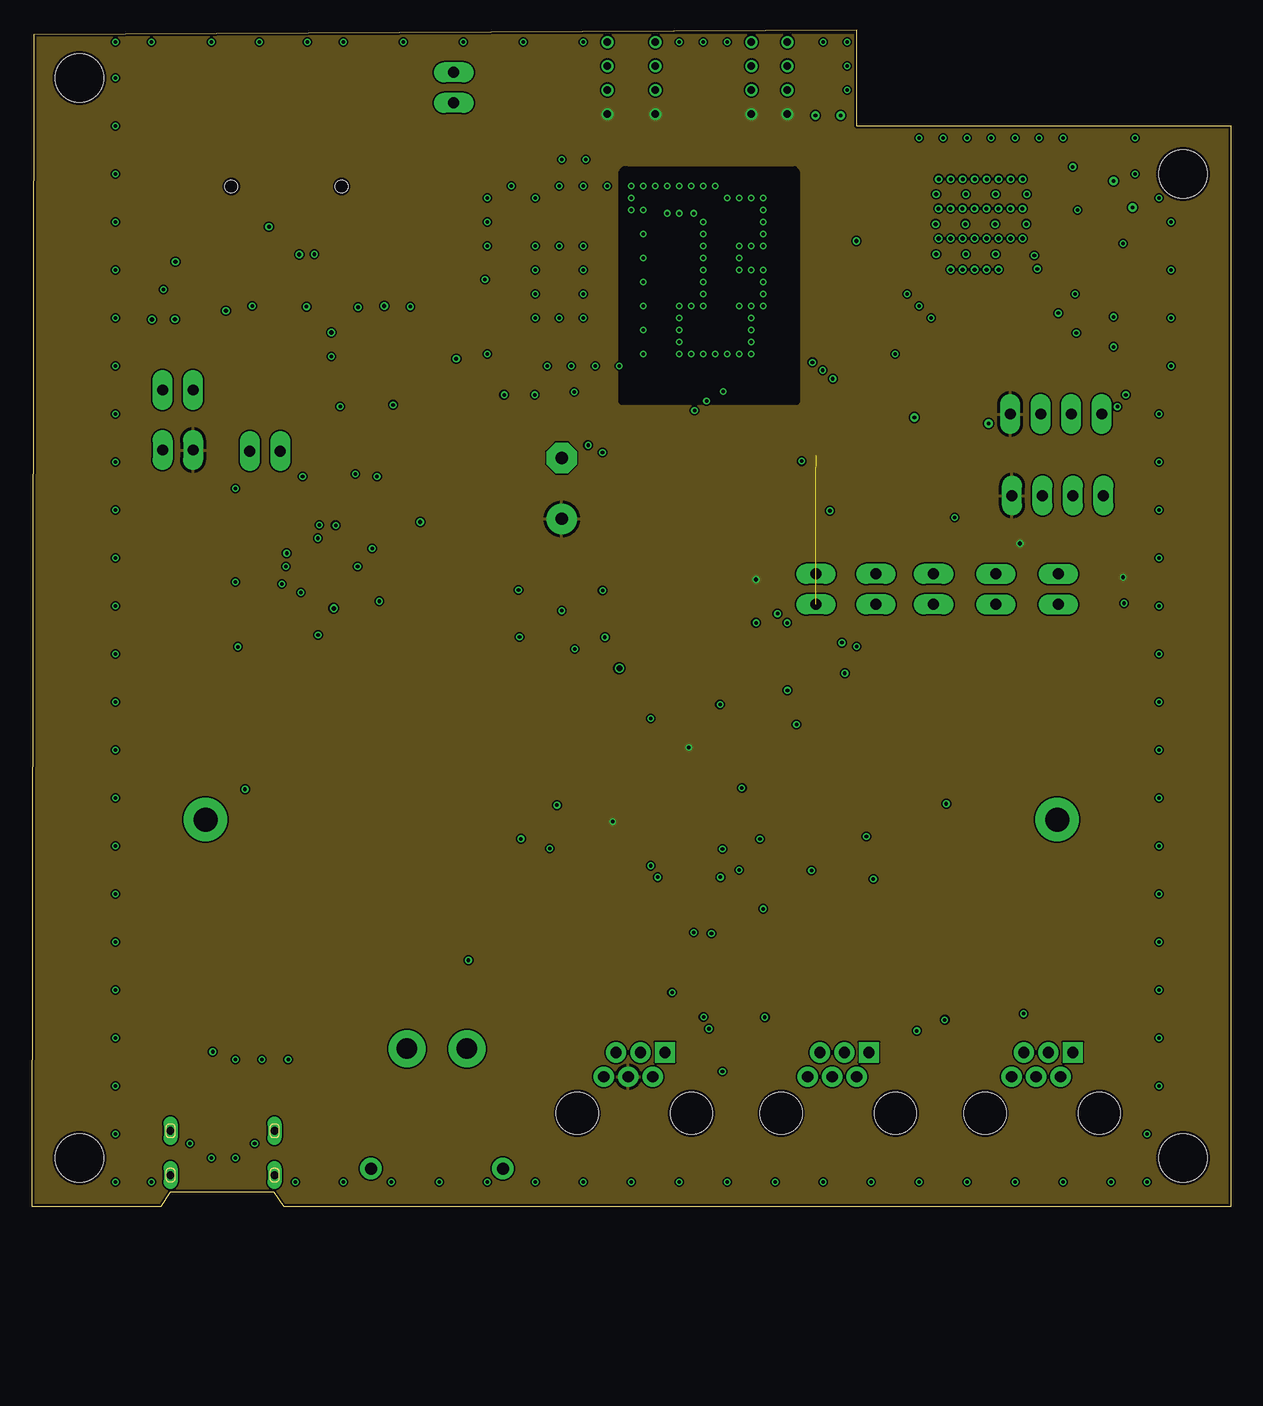
[diagram p5: board, inner layer Route2]
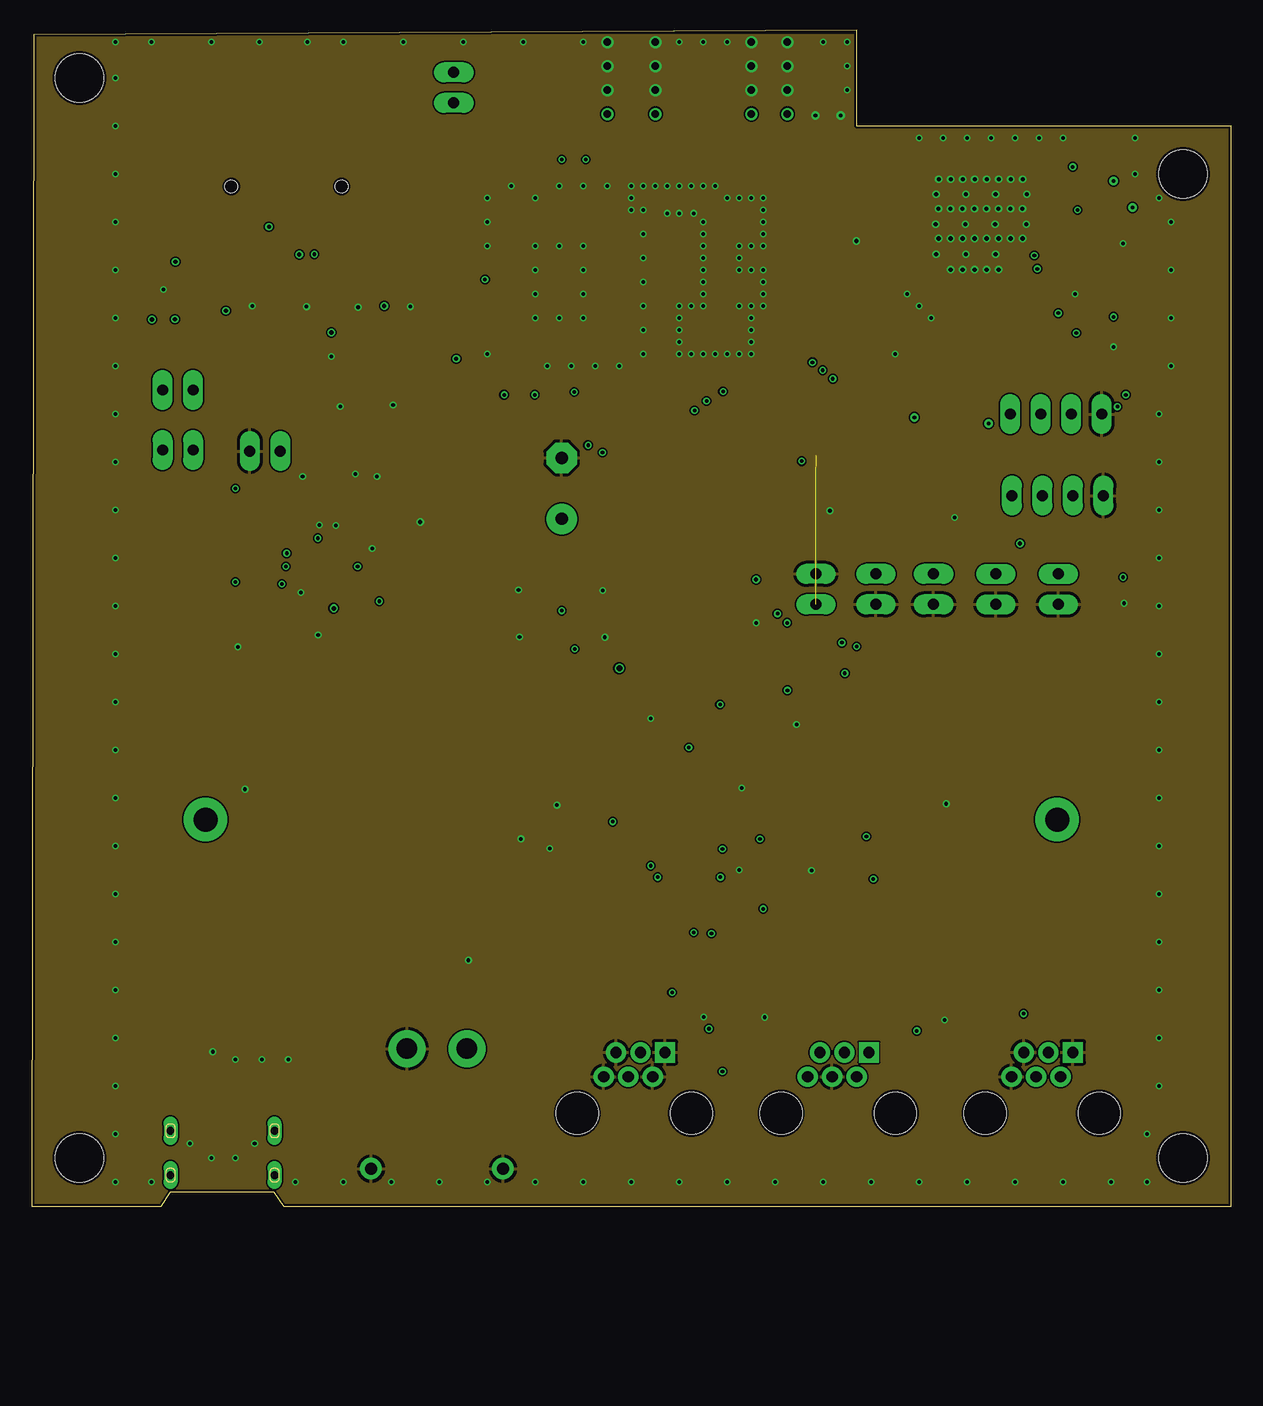
[diagram p6: board, inner layer Route15]
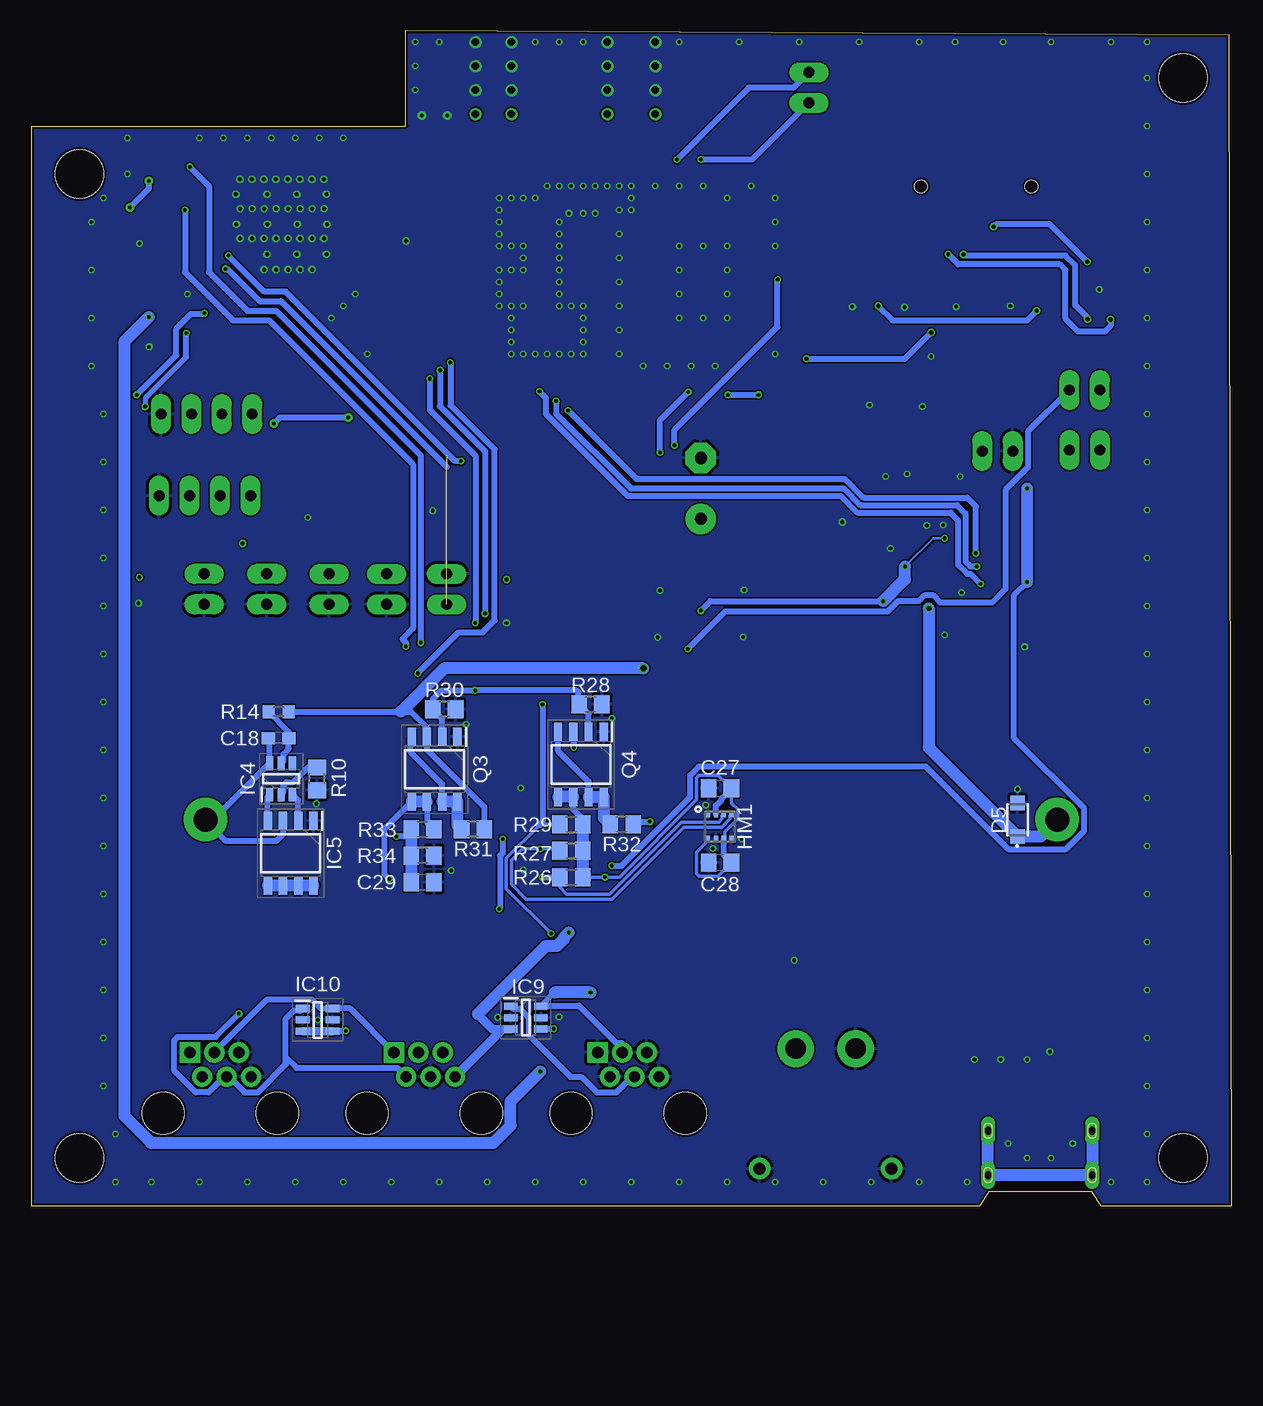
[diagram p7: board, bottom side, seen from below]

Size 100 x 98 mm. Coordinates in mm from the lower left corner, seen from the top.
Outline: 0,0 10.8,0 11.6,1.2 20.2,1.2 21,0 100,0 100,90 68.8,90 68.8,98 0.2,97.6 0,0
Copper layers (1+2*15+16): Top 0.035mm / dielectric 0.2104mm / Route2 0.0152mm / dielectric 1.065mm / Route15 0.0152mm / dielectric 0.2104mm / Bottom 0.035mm
Design rules "jlcpcb-4layers *": minimum track width 3.5mil, minimum drill 0.3mm, track to track 5mil, track to pad 0.2mm, pad to pad 5mil, via to via 0.5mm, smd to smd 5mil, copper to edge 0.2mm, drill to drill 6mil, minimum pad ring 10mil, minimum via ring 0.13mm, stop-mask expansion 0.05mm, vias tented up to drill 16mil, thermal gap 10mil
Holes 4.05 mm at 4,94 4,4 96,4 96,86

### Footprints (pad centres in the part's own frame; a part is rotated, then mirrored left to right if it is on the bottom)
USCX-06FX-XXMX-01 = smd 0.7 x 1.2: CC1 0.5,-1.75; CC2 -0.5,-1.75 | smd 0.9 x 1.2: GND1 2.75,-1.75; GND2 -2.75,-1.75 | drill 0.65 pad 1.092 long: SHIELD1 4.325,1.95; SHIELD2 4.325,-1.75; SHIELD3 -4.35,-1.75; SHIELD4 -4.35,1.95 | smd 0.8 x 1.2: VBUS1 1.5,-1.75; VBUS2 -1.5,-1.75
BLOSSOM-BLM-18650-1PCS = drill 2: 1 -71.5,0; 2 -0.5,0
C0603 = smd 1.1 x 1: 1 -0.85,0; 2 0.85,0
PANASONIC_D = smd 3 x 1.4: + 2.4,0; - -2.4,0
E5-10,5 = drill 1.016 pad 2.54: + -2.54,0 | drill 1.016 pad 2.54 octagon: - 2.54,0
C0805 = smd 1.3 x 1.5: 1 -0.95,0; 2 0.95,0
SOD123W = smd 1.2 x 1.2: 1 -1.4,0; 2 1.4,0
SODFL2512X80N = smd 0.84 x 0.46: 1 -1.15,0; 2 1.15,0
BME280 = smd 0.5 x 0.35: 1 2.05,0; 2 2.05,-0.65; 3 2.05,-1.3; 4 2.05,-1.95; 5 0,-1.95; 6 0,-1.3; 7 0,-0.65; 8 0,0
ESP32WROOM32EM113EH3200PH3Q0 = smd 2 x 0.9: 1 0,0; 2 0,-1.27; 3 0,-2.54; 4 0,-3.81; 5 0,-5.08; 6 0,-6.35; 7 0,-7.62; 8 0,-8.89; 9 0,-10.16; 10 0,-11.43; 11 0,-12.7; 12 0,-13.97; 13 0,-15.24; 14 0,-16.51; 25 17,-16.51; 26 17,-15.24; 27 17,-13.97; 28 17,-12.7; 29 17,-11.43; 30 17,-10.16; 31 17,-8.89; 32 17,-7.62; 33 17,-6.35; 34 17,-5.08; 35 17,-3.81; 36 17,-2.54; 37 17,-1.27; 38 17,0 | smd 0.9 x 2: 15 2.785,-17.51; 16 4.055,-17.51; 17 5.325,-17.51; 18 6.595,-17.51; 19 7.865,-17.51; 20 9.135,-17.51; 21 10.405,-17.51; 22 11.675,-17.51; 23 12.945,-17.51; 24 14.215,-17.51 | smd 1.33 x 1.33: 39 5,-5; 40 5,-7.5; 41 5,-10; 42 7.5,-10; 43 7.5,-7.5; 44 7.5,-5; 45 10,-5; 46 10,-7.5; 47 10,-10
BC660KGL = smd 0.7 x 0.7: 1 -7.65,6.6; 2 -7.65,5.5; 3 -7.65,4.4; 4 -7.65,3.3; 5 -7.65,2.2; 6 -7.65,1.1; 7 -7.65,0; 8 -7.65,-1.1; 9 -7.65,-2.2; 10 -7.65,-3.3; 11 -7.65,-4.4; 12 -7.65,-5.5; 13 -7.65,-6.6; 14 -4.4,-8.6; 15 -3.3,-8.6; 16 -2.2,-8.6; 17 -1.1,-8.6; 18 0,-8.6; 19 1.1,-8.6; 20 2.2,-8.6; 21 3.3,-8.6; 22 4.4,-8.6; 23 7.65,-6.6; 24 7.65,-5.5; 25 7.65,-4.4; 26 7.65,-3.3; 27 7.65,-2.2; 28 7.65,-1.1; 29 7.65,0; 30 7.65,1.1; 31 7.65,2.2; 32 7.65,3.3; 33 7.65,4.4; 34 7.65,5.5; 35 7.65,6.6; 36 4.4,8.6; 37 3.3,8.6; 38 2.2,8.6; 39 1.1,8.6; 40 0,8.6; 41 -1.1,8.6; 42 -2.2,8.6; 43 -3.3,8.6; 44 -4.4,8.6 | smd 1 x 1: 45 -3.6,2.7; 46 -3.6,0.9; 47 -3.6,-0.9; 48 -3.6,-2.7; 49 -1.8,-4.5; 50 0,-4.5; 51 1.8,-4.5; 52 3.6,-2.7; 53 3.6,-0.9; 54 3.6,0.9; 55 3.6,2.7; 56 1.8,4.5; 57 0,4.5; 58 -1.8,4.5
SOT95P280X145-6N = smd 1.15 x 0.6: 1 -1.25,0.95; 2 -1.25,0; 3 -1.25,-0.95; 4 1.25,-0.95; 5 1.25,0; 6 1.25,0.95
SOT95P285X140-6N = smd 1.15 x 0.6: 1 -1.3,0.95; 2 -1.3,0; 3 -1.3,-0.95; 4 1.3,-0.95; 5 1.3,0; 6 1.3,0.95
SOIC127P600X175-8N = smd 1.525 x 0.7: 1 -2.712,1.905; 2 -2.712,0.635; 3 -2.712,-0.635; 4 -2.712,-1.905; 5 2.712,-1.905; 6 2.712,-0.635; 7 2.712,0.635; 8 2.712,1.905
QFN50P400X400X100-21N = smd 0.8 x 0.3: 1 -2,1; 2 -2,0.5; 3 -2,0; 4 -2,-0.5; 5 -2,-1; 11 2,-1; 12 2,-0.5; 13 2,0; 14 2,0.5; 15 2,1 | smd 0.3 x 0.8: 6 -1,-2; 7 -0.5,-2; 8 0,-2; 9 0.5,-2; 10 1,-2; 16 1,2; 17 0.5,2; 18 0,2; 19 -0.5,2; 20 -1,2 | smd 2.8 x 2.8: 21 0,0
SOT95P270X145-5N = smd 1.4 x 0.6: 1 -1.25,0.95; 2 -1.25,0; 3 -1.25,-0.95; 4 1.25,-0.95; 5 1.25,0.95
U.FL-R-SMT(10) = smd 1.05 x 2.2: GND -1.475,0; GND1 1.475,0 | smd 1 x 1: SIG 0,-1.525
SIM7100611500A = smd 0.9 x 1.35: C1 2.765,8.551; C2 0.225,8.551; C3 -2.315,8.551; C4 -4.855,8.551; C5 1.495,8.551; C6 -1.045,8.551; C7 -3.585,8.551; C8 -6.125,8.551; CD1 -7.395,8.551 | smd 1.56 x 2.61: MP1 8.73,5.676; MP2 -8.73,5.676; MP3 8.73,-6.954; MP4 -8.73,-6.954 | hole 1.05: -5.852,4.046; 3.348,4.046
XT30PWM = drill 1.7 pad 2.55: 1 -2.5,-5.912; 2 2.5,-5.912 | drill 1 pad 1.5: 3 5.5,4.088; 4 -5.5,4.088
RJE0166001 = drill 0.94 pad 1.462 square: 1 0,0 | drill 0.94 pad 1.462: 2 -1.02,-2.03; 3 -2.04,0; 4 -3.06,-2.03; 5 -4.08,0; 6 -5.1,-2.03 | hole 3.5: 2.22,-5.08; -7.3,-5.08
JP1 = drill 0.914 long: 1 0,-1.27; 2 0,1.27
JP4 = drill 0.914 long: 1 -3.81,0; 2 -1.27,0; 3 1.27,0; 4 3.81,0
CHIPLED_0805 = smd 1.2 x 1.2: A 0,-1.05; C 0,1.05
SOT65P210X110-3N = smd 0.99 x 0.5: 1 -0.97,0.65; 2 -0.97,-0.65; 3 0.97,0
R0603 = smd 1 x 1.1: 1 -0.85,0; 2 0.85,0
R0805 = smd 1.3 x 1.5: 1 -0.95,0; 2 0.95,0
SJ = smd 1.168 x 1.6: 1 -0.762,0; 2 0.762,0
SJ_2 = smd 1.168 x 1.6: 1 -1.524,0; 2 0,0; 3 1.524,0

### Placement (x,y rotation side)
$3_29_$_2023-03-21_17-43-41  15.91,4.52 180 top
$3_30_$_2023-03-21_17-43-41  86,32.2 0 top
C1  89.2,50.2 0 top
C2  61.4,92.8 270 top
C4  65.34,88.9 270 top
C5  67.46,88.91 270 top
C6  18.4,77 270 top
C7  22.8,77 270 top
C8  27.2,77 270 top
C9  40.8,90.2 90 top
C10  31.6,77 270 top
C11  43,90.2 90 top
C12  58.05,81.8 0 top
C13  45.2,90.2 90 top
C14  49.8,92.8 270 top
C15  58.05,76.6 0 top
C16  14,77 90 top
C17  31.4,58.8 270 top
C18  79.4,39 180 bottom
C19  22.6,58.8 90 top
C20  29.2,58.8 90 top
C21  46,50.4 0 top
C22  39,50.4 0 top
C23  28.4,52.8 90 top
C24  42.2,50.4 180 top
C25  49.2,50.4 180 top
C26  44.2,59.8 90 top
C27  42.6,34.8 0 bottom
C28  42.6,28.6 180 bottom
C29  67.4,27 0 bottom
D1  36.4,17.8 90 top
D2  14.8,10.4 90 top
D3  34.35,17.6 270 top
D4  12.71,10.1 270 top
D5  17.8,32.2 90 bottom
HM1  43.6,30.6 90 bottom
IC1  71.63,89.32 0 top
IC2  44.14,77.24 0 top
IC3  11,76.4 270 top
IC4  79.2,35.6 90 bottom
IC5  78.4,29.4 270 bottom
IC6  24.2,52.8 270 top
IC7  40.8,47.4 0 top
IC8  47.8,47.4 0 top
IC9  58.79,15.7 0 bottom
IC10  76.15,15.51 0 bottom
J1  57.2,72.8 180 top
J2  20,89 180 top
J3  33.8,7.2 180 top
J4  52.8,12.8 0 top
J5  69.8,12.8 0 top
J6  86.8,12.8 0 top
JP1  85.6,51.4 0 top
JP2  80.4,51.4 0 top
JP3  75.2,51.4 180 top
JP4  70.4,51.4 180 top
JP5  65.4,51.4 180 top
JP6  85.4,66 0 top
JP7  85.55,59.2 0 top
JP8  35.2,93.2 180 top
JP9  19.47,62.91 270 top
JP10  12.2,68 90 top
JP11  12.2,63 270 top
LED1  19.4,68.6 270 top
LED2  11.2,57.6 270 top
LED3  11.2,55.4 270 top
LED4  11.2,48.8 270 top
Q1  30.2,66 180 top
Q2  25.8,65.8 180 top
Q3  66.4,36.4 270 bottom
Q4  54.2,36.8 270 bottom
R1  89.2,52.4 0 top
R2  80.6,55.2 0 top
R3  62.2,51.4 90 top
R4  16.2,77 270 top
R5  20.6,77 90 top
R6  25,77 90 top
R7  29.4,77 90 top
R8  57.2,79.2 270 top
R9  19.4,66.8 180 top
R10  76.2,35.6 90 bottom
R11  21.4,10.4 90 top
R12  17,10.4 90 top
R13  19.2,10.4 90 top
R14  79.4,41.2 0 bottom
R15  24.8,58.8 90 top
R16  27,58.8 90 top
R17  19.2,57.6 0 top
R18  19.2,55.4 0 top
R19  19.2,48.8 0 top
R20  19.2,59.8 0 top
R21  19.2,53.2 0 top
R22  19.2,51 0 top
R23  19.2,46.6 180 top
R24  22.8,47.6 270 top
R25  25,47.6 270 top
R26  55,27.4 0 bottom
R27  55,29.6 0 bottom
R28  53.4,41.8 180 bottom
R29  55,31.8 0 bottom
R30  65.6,41.4 180 bottom
R31  63.2,31.4 180 bottom
R32  50.8,31.8 180 bottom
R33  67.4,31.4 0 bottom
R34  67.4,29.2 180 bottom
SJ1  78.2,65.6 270 top
SJ2  75.2,65.6 270 top
SJ3  30.65,17.6 90 top
SJ4  10.5,10.1 90 top
SJ5  35.6,50.4 90 top

### Tracks (layer width: path | path; a pad name or v marks a point on that pad's centre or on a via)
!PG  (via drill 0.3 pad 0.3)
  Top 0.2: R17.2 22.2,55.45 IC6.6 21.87,53.8 v21.27,54.4
  Top 0.5: IC1.12 70.35,75.35 69.2,74.2 69.2,67.8 67.7,66.3 v55.27,66.3
  Top 1: R17.2 R20.2
  Bottom 0.5: v55.27,66.3 49.57,60.6 32.2,60.6 30.63,59.03 22,59.03 21.27,58.31 v21.27,54.4
!TE1
  Top 0.2: IC6.9 22.15,52.25 21.68,52.25 21.5,52.07 21.5,48.05 R23.1
BAT-
  Bottom 0.5: C18.2 80.15,38.9 IC4.6 84.85,32.2 $3_30_$_2023-03-21_17-43-41.2 85.5,32.1 83.8,30.4 79.6,30.4 79.03,30.96 IC5.3
BAT_Q  (via drill 0.3 pad 0.3)
  Top 0.5: v70.17,27.25 70.17,27.42 68.76,28.83 52.11,28.83 v51.62,28.35
  Top 1: R21.1 18.35,52 | 18.35,52 R22.1 | 18.35,52 v17,52 | v17,59.8 R20.1
  Bottom 0.5: Q3.6 67.03,31.98 R33.2 | Q3.5 70.6,31.39 70.6,27.67 v70.17,27.25 | v51.62,28.35 50.81,28.35 45.08,34.09 45.08,35.91 44.36,36.63 25.46,36.63 18.59,29.75 13.77,29.75 12.25,31.27 12.25,33.13 18.11,38.99 18.11,50.89 v17,52
  Bottom 1: Q3.6 Q3.5 | v17,52 v17,59.8
BOOT  (via drill 0.3 pad 0.3)
  Top 0.5: JP4.1 70.4,62.4 69.22,63.58 46.58,63.58 v46.4,63.4 | v37.8,77.2 36.53,77.2 IC2.7
  Bottom 0.5: v46.4,63.4 46.4,64.67 37.8,73.27 v37.8,77.2
CC3
  Top 0.7: $3_29_$_2023-03-21_17-43-41.CC2 16.46,6.32 16.46,7.1 17.36,8 18.6,8 19.2,8.6 R13.1
CC4
  Top 0.7: $3_29_$_2023-03-21_17-43-41.CC1 15.51,6.37 15.51,7.32 17,8.81 R12.1
DRAIN1
  Bottom 1: IC5.8 IC5.7 IC5.6 IC5.5
DRIVE_PIN  (via drill 0.3 pad 0.3)
  Top 0.5: IC1.9 70.36,79.16 67.25,76.05 67.25,69.65 66.8,69.2 v66.8,68.93 | v63,48.6 63,42.99 v63.02,42.98
  Bottom 0.5: Q3.2 65.77,40.62 R30.2 66.55,42.25 65.83,42.98 v63.02,42.98 54.58,42.98 54.4,42.8 54.4,41.85 R28.2 53.56,41.02 Q4.2 | v66.8,68.93 66.8,66.33 63,62.53 v63,48.6
DS18B_SIG  (via drill 0.3 pad 0.3)
  Top 0.5: J5.5 58.45,12.8 v56.47,14.78 56.38,14.87 55.7,14.87 55.23,15.33 55.23,21.26 v56.69,22.71 | IC1.8 71.6,80.4 70.2,80.4 66.61,76.81 66.61,70.31 v65.94,69.65 | v62.19,49.36 62.19,47.19 57.4,42.4 v57.4,41.8
  Bottom 0.3: v56.69,22.71 60.43,26.45 60.43,28.98 57.7,31.7 57.6,31.8 R29.1
  Bottom 0.5: IC9.4 57.52,14.78 v56.47,14.78 | v65.94,69.65 65.94,66.64 62.19,62.88 v62.19,49.36 | v57.4,41.8 57.4,32 57.7,31.7
ESP_BOOT  (via drill 0.3 pad 0.3)
  Top 0.5: JP2.2 79.75,53.32 R2.1 79.75,56.35 80.5,57.1 89.89,57.1 90.63,57.85 90.63,60.55 90.52,60.66 v90.52,66.61 | v87.1,72.75 87.16,72.81 IC1.25
  Bottom 0.4: v90.52,66.61 90.52,67.31 87.1,70.73
  Bottom 0.5: v90.52,66.61 | 87.1,70.73 v87.1,72.75
ESP_ENABLE  (via drill 0.3 pad 0.3)
  Top 0.5: C1.1 R1.1 | JP1.2 85.67,52.6 88.15,52.6 R1.1 | R1.1 88.35,54.68 91.33,57.66 91.33,67.49 v91.23,67.6 | v85.6,74.4 78.4,74.4 73.8,79 73.8,85.6 72.62,86.78 IC1.3
  Bottom 0.5: v91.23,67.6 87.93,70.89 87.93,73.1 86.7,74.33 85.67,74.33 v85.6,74.4
FLASH_RX
  Top 0.5: JP6.3 86.67,66.87 88.2,68.4 91.77,68.4 93.25,69.88 93.25,82.95 91.97,84.24 IC1.34
FLASH_TX  (via drill 0.3 pad 0.7)
  Top 0.5: JP6.2 85.4,67.27 85.4,67.35 87.07,69.03 91.51,69.03 92.63,70.14 92.63,82.37 v91.8,83.2 | v90.2,85.4 88.74,85.4 IC1.35
  Bottom 0.5: v91.8,83.2 90.2,84.8 v90.2,85.4
G3
  Bottom 0.5: IC5.4 80.31,34.15 IC4.1
G4
  Bottom 0.5: IC5.2 77.77,33.81 IC4.3
G_BAT
  Bottom 0.5: Q3.7 65.77,35.16 68.4,37.8 68.4,39.02 Q3.4
  Bottom 1: Q3.7 Q3.8 64.5,31.75 R31.2
G_SENS
  Bottom 0.5: Q4.7 53.56,35.37 56.1,37.91 Q4.4
  Bottom 1: Q4.7 Q4.8 52.3,32.34 R32.2
GND  (via drill 0.3, 0.3 pad 0.3, 0.3 pad 0.4, 0.3 pad 0.5, 0.3 pad 0.7, 0.35, 0.6 pad 1)
  Top 0.5: C6.2 v18.4,75 | C7.2 22.93,76.02 v22.93,74.95 | C8.2 27.23,76.12 v27.23,74.89 | C10.2 31.57,76.12 v31.57,74.95
  Top 0.7: v22.46,51.13 24.13,52.8 IC6.21
  other vias: 51.61,40.63 43.8,33.4 43.2,29.8 40.8,30.6 76.26,33.52 76.95,57.37 91.08,50.23 67.45,90.89 65.35,90.89 10.99,76.38 22.6,60.8 27,61 28.8,60.8 28.4,54.8 23.89,47.58 17.2,46.6 32.4,57 25.73,66.63 30.14,66.76 47.8,47.4 40.68,47.41 47.61,51.29 40.6,51.33 17,12.2 15.1,12.85 19.2,12.2 21.4,12.2 36.43,20.48 18.6,5.2 13.2,5.2 56.03,15.75 61.13,15.73 76.13,15.51 17.8,34.73 75.63,85.57 76.63,85.57 77.63,85.57 78.63,85.57 79.63,85.57 80.63,85.57 81.63,85.57 82.63,85.57 75.61,83.11 76.61,83.11 77.61,83.11 78.61,83.11 79.61,83.11 80.61,83.11 81.61,83.11 82.61,83.11 75.62,80.63 76.62,80.63 77.62,80.63 78.62,80.63 79.62,80.63 80.62,80.63 81.62,80.63 82.62,80.63 77.89,84.31 80.37,84.31 75.41,84.31 82.97,84.31 77.89,79.31 80.37,79.31 75.41,79.31 40,85 42,84 44,85 46,85 48,85 38,84 38,82 38,80 42,80 44,80 46,80 42,78 46,78 42,76 46,76 46,74 44,74 42,74 38,71 43,70 45,70 47,70 49,70 51,71 51,75 51,73 51,77 51,79 51,81 51,83 50,83 50,84 50,85 51,85 52,85 53,85 54,85 55,85 56,85 57,85 58,84 59,84 60,84 61,84 61,83 61,82 61,81 61,80 60,80 59,80 59,79 59,78 60,78 53,82.72 54,82.72 55.2,82.72 56,82 56,81 56,80 56,79 56,78 56,77 56,76 56,75 55,75 54,75 54,74 54,73 54,72 54,71 55,71 56,71 57,71 58,71 59,71 60,71 60,72 60,73 60,74 60,75 59,75 61,75 61,76 61,77 61,78 74,89 76,89 78,89 80,89 82,89 84,89 86,89 77.85,81.82 80.33,81.82 75.37,81.82 82.93,81.82 76.62,78.03 77.62,78.03 78.62,78.03 79.62,78.03 80.62,78.03 72,71 75,74 74,75 73,76 87,76 60,97 60,95 60,93 63,95 63,97 63,93 48,93 48,95 48,97 52,97 52,95 52,93 59,28 66.56,57.94 7,97 7,2 7,6 7,10 7,14 7,18 7,22 7,26 7,30 7,34 7,38 7,42 7,46 7,50 7,54 7,58 7,62 7,66 7,70 7,74 7,78 7,82 7,86 7,90 7,94 10,2 15,4 17,4 22,2 26,2 30,2 34,2 38,2 42,2 46,2 50,2 54,2 58,2 62,2 66,2 70,2 74,2 78,2 82,2 86,2 90,2 93,2 93,6 94,10 94,14 94,18 94,22 94,26 94,30 94,34 94,38 94,42 94,46 94,50 94,54 94,58 94,62 94,66 95,70 95,74 95,78 95,82 94,84 92,86 92,89 68,93 68,95 68,97 66,97 58,97 56,97 54,97 46,97 41,97 36,97 31,97 26,97 23,97 19,97 15,97 10,97 25,70.79 24,56.75 25.36,56.72 65.02,27.96 63.77,40.12 60.4,48.6 59.21,34.83 91,80.2 90.2,71.6 68.77,80.42
  pour Top (isolate 0.191): 51,85.8 61.4,85.8 61.4,69 50.2,69 50.2,70.2 50.2,85.8
  pour Route15: 0,0 0,97.6 0.2,97.6 100,97.6 100,0
  pour Top: 0,0 0,97.6 0.2,97.6 100,97.6 100,0
  pour Bottom: 0,0 0,97.6 100,97.6 100,0
I2C_SCL  (via drill 0.3 pad 0.3)
  Top 0.5: v82.7,16.02 82.62,16.02 68.9,29.75 v57.6,29.75 57.6,36.16 64.13,42.7 64.13,43.52 v67.55,46.94 | IC1.36 86.98,86.78 v86.8,86.6
  Bottom 0.3: HM1.4 41.77,32.52 41.77,32.26 42.46,31.57 45.62,31.57 51.62,25.57 58.77,25.57 60,26.8 60,28.8 59.05,29.75 v57.6,29.75 56.1,29.75 R27.1
  Bottom 0.5: J5.2 69.51,11.5 77.9,11.5 78.8,12.4 | IC10.1 77.6,16.26 78.16,16.26 78.8,15.62 78.8,12.4 | 78.8,12.4 78.8,11.8 81.13,9.47 82.24,9.47 83.53,10.77 J6.4 83.95,10.77 85.24,9.47 86.32,9.47 88.1,11.25 88.1,13.83 87.83,14.1 84.63,14.1 v82.7,16.02 | v67.55,46.94 67.55,62.55 79.6,74.6 82,74.6 85.2,77.8 85.2,85 v86.8,86.6
I2C_SDA  (via drill 0.3 pad 0.3)
  Top 0.5: v57.42,27.4 60.06,24.77 v61,24.77 72.79,24.77 J6.3 | IC1.33 87.23,82.97 v87.2,83 | v68.79,46.63 64.76,42.6 64.76,42.44 60.72,38.4 v60.72,30.58
  Bottom 0.3: HM1.3 42.42,32.53 42.42,32.26 42.68,32 45.8,32 51.8,26 55.4,26 55.95,26.55 R26.1
  Bottom 0.5: J5.1 73.46,16.46 IC10.6 75.89,16.46 76.64,17.21 80.35,17.21 J6.3 | v57.42,27.4 R26.1 | v87.2,83 87.2,77.8 83.2,73.8 80.2,73.8 68.2,61.8 68.2,48.13 69.09,47.25 68.79,46.95 v68.79,46.63 | v60.72,30.58 60.72,29.43 60.95,29.2 60.95,24.81 v61,24.77
N$1  (via drill 0.3)
  Top 0.5: v46.2,87.2 46.4,87 46.4,85.9 IC2.38
  Bottom 0.5: JP8.1 36.47,93.2 40.2,93.2 v46.2,87.2
N$2  (via drill 0.3)
  Top 0.5: v44.2,87.2 45.24,86.16 IC2.39
  Bottom 0.5: JP8.2 39.93,87.2 v44.2,87.2
N$3
  Top 0.5: SJ2.1 77.04,68.2 79.15,68.2 80.18,69.23 85.5,69.23 86.55,70.28 90.8,70.28 91.37,70.85 91.37,74.8 90.82,75.35 IC1.27
N$4
  Top 0.5: SJ1.1 80.44,68.6 85.76,68.6 86.81,69.65 91.25,69.65 92,70.4 92,76.4 91.78,76.62 IC1.28
N$5
  Bottom 0.5: IC4.5 79,37.1 79,37.66 78.55,38.11 C18.1 78.55,39.5 R14.1
N$6  (via drill 0.3 pad 0.3)
  Top 0.5: v45.28,46.42 46.52,46.42 IC8.3
  Bottom 0.5: JP10.1 16.93,64.54 16.93,61.56 18.8,59.69 18.8,51.4 19.91,50.29 24.25,50.29 24.84,50.88 25.56,50.88 26.04,50.4 27.76,50.4 28.64,49.52 42.18,49.52 v45.28,46.42
N$7
  Top 1: LED2.C R17.1
N$8
  Top 1: LED3.C R18.1
N$9
  Top 1: LED4.C R19.1
N$16
  Top 0.5: LED1.C 19.65,67.8 19.56,67.8 18.56,66.8 R9.2
N$17
  Top 1: R9.1 23.83,66.8 Q2.3
N$19
  Top 1.1: IC2.35 55.16,83.84 arc-90 C12.1 R8.1
N$20
  Top 1.1: R8.2 C15.1 J1.SIG
N$21  (via drill 0.35)
  Top 0.5: C7.1 R5.2 20.6,78.6 19.8,79.4 19.8,80.42 J2.C2 19.8,80.47 v19.8,81.6 | v11.99,78.69 11.99,77.69 IC3.1
  Bottom 0.5: v11.99,78.69 15.1,81.8 19.6,81.8 v19.8,81.6
N$22  (via drill 0.35)
  Top 0.15: 22.9,78.7 25,78.7
  Top 0.2: 25,78.7 R6.2 | v22.32,79.28 22.9,78.7
  Top 0.5: R6.2 C8.1 | J2.C3 v22.32,79.28 | IC3.6 v11.95,73.9 v11.96,73.9
  Bottom 0.5: v11.96,73.9 11.9,73.96 13,75.06 13,78.4 13.8,79.2 22.23,79.2 v22.32,79.28
N$23  (via drill 0.3, 0.35)
  Top 0.2: J2.C7 23.6,80.43 v23.6,79.33 v23.59,79.31 23.67,79.4 28.6,79.4 29.4,78.6 R7.2
  Top 0.5: R7.2 C10.1 | IC3.4 v10.04,73.87
  Bottom 0.5: v10.04,73.87 10.04,73.37 10.54,72.87 12.74,72.87 13.8,73.93 13.8,78 14.28,78.48 22.75,78.48 v23.59,79.31
N$86
  cutout Route2: 49.6,86.4 63.6,86.4 63.8,86.2 63.8,67 49.2,67 49.2,86.2 49.4,86.4
NETLIGHT  (via drill 0.3 pad 0.3)
  Top 0.2: Q2.1 29.22,67.6 v39.4,67.6
  Top 0.5: v41.95,67.6 v41.94,67.61 IC2.16
  Bottom 0.5: v41.95,67.6 v39.4,67.6
OUT
  Top 0.2: 25.2,55.4 IC6.1 25.8,54.8 26.2,54.4 IC6.20
  Top 0.4: 25.2,55.4 26,56.2
  Top 0.5: SJ5.3 31.32,56.2 29.8,56.2 29.3,56.7 | 26,56.2 26.5,56.7 29.3,56.7 | 29.3,56.7 29.2,56.8 C20.1
PROG1
  Top 0.2: IC6.13 24.2,49.35 R25.1
PROG3
  Top 0.2: IC6.12 23.7,49.9 22.8,49 R24.1
PSM_EINT  (via drill 0.3 pad 0.3)  (2 unrouted)
  Top 0.5: 65.4,62.56 65,62.96 47.76,62.96 v47.6,62.8 | v45.24,67.84 IC2.19 | IC1.29 88.43,78.09 v83.85,78.09 v83.85,78.1 | R3.1 64.25,50.55 64.67,50.13 JP5.2
  Bottom 0.5: v47.6,62.8 47.6,65.48 v45.24,67.84 | v83.85,78.1 83.7,78.1 81,75.4 79.2,75.4 65.4,61.6
PV_IN1
  Top 0.6: D1.1 36.35,16.45 D3.2 31.04,16.45 SJ3.1
  Top 1: D1.1 36.4,13.21 J3.1
RAIN_GAUGE_INPUT  (via drill 0.3 pad 0.3)
  Top 0.5: IC1.26 90.18,74.08 v90.2,74.1
  Top 1: v57.6,11.2 53.4,15.4 v53.4,17.8
  Bottom 0.5: J4.3 50.76,13.56 50.8,13.6 51.27,13.6 54.38,16.7 57.49,16.7 IC9.6 56.39,17.8
  Bottom 1: v90.2,74.1 92.27,72.03 92.27,7.5 90.03,5.27 61.48,5.27 60.05,6.71 60.05,8.75 v57.6,11.2 | v53.4,17.8 56.39,17.8
RESET_N
  Top 0.2: Q1.3 38.8,66 40.84,68.04 40.84,68.6 IC2.15
  Top 0.5: C17.1 29.23,61.82 Q1.3 | 74.55,53.32 JP3.1 73.4,54.47 73.4,63.2 72.39,64.21 45.7,64.21 43.51,66.4 41.6,66.4 40.8,67.2 40.8,68.56 40.84,68.6
RESET_QUECTEL  (via drill 0.3 pad 0.3)
  Top 0.5: Q1.1 37.45,65.35 43,59.8 46.2,59.8 48.47,62.07 v64.2,62.07 | v83.6,79.2 88.59,79.2 IC1.30
  Bottom 0.5: v64.2,62.07 64.67,62.07 78.8,76.2 80.6,76.2 v83.6,79.2
S1
  Top 0.7: $3_29_$_2023-03-21_17-43-41.SHIELD3 21.4,7.41 R11.1
  Bottom 1: $3_29_$_2023-03-21_17-43-41.SHIELD2 $3_29_$_2023-03-21_17-43-41.SHIELD1 $3_29_$_2023-03-21_17-43-41.SHIELD4 $3_29_$_2023-03-21_17-43-41.SHIELD3
SENS_VDD33  (via drill 0.3 pad 0.3)
  Top 0.5: J6.2 85.57,10.77 84.28,9.47 81.16,9.47 79.87,10.77 77.63,10.77 v73.8,14.6 69,14.6 67.76,13.36 J5.3 53.16,27.4 v52.2,27.4
  Bottom 0.3: C28.1 42.76,27.5 44.34,27.5 44.55,27.7 44.55,29.5 43.6,30.45 HM1.8 | HM1.6 42.17,30.73 42.17,31.2 41.12,32.26 41.12,33.05 41.65,33.57 C27.2 42.76,35.9 44.34,35.9 44.55,35.7 44.55,33.85 51,27.4 v52.2,27.4 R26.2
  Bottom 0.5: IC10.4 74.86,14.6 v73.8,14.6 | R29.2 54.09,32.29 54.84,33.03 Q4.6 | C27.2 42.45,34 42.45,33.86 42.95,33.36 HM1.2 | HM1.6 42.3,29.25 C28.1
  Bottom 0.7: IC10.4 IC10.3
  Bottom 1: Q4.6 Q4.5 | R29.2 R27.2 R26.2
STAT1  (via drill 0.3 pad 0.3)
  Top 0.2: R22.2 20.05,51.02 v20.86,51.83 21.17,52.14 21.17,52.25 21.73,52.8 IC6.8
  Top 0.5: IC1.10 71.26,77.52 70.44,77.52 67.93,75 67.93,68.73 67.05,67.85 57.67,67.85 v57.65,67.87
  Top 1: R22.2 R19.2
  Bottom 0.5: v57.65,67.87 57.13,67.35 57.13,66.01 50.3,59.17 32.55,59.17 31.15,57.78 23.4,57.78 22.76,57.14 22.76,53.44 22,52.67 21.71,52.67 v20.86,51.83
STAT2  (via drill 0.3 pad 0.3)
  Top 0.2: R21.2 20.15,53.3 v21.2,53.3 IC6.7
  Top 0.5: IC1.11 71.26,76.25 70.36,76.25 68.57,74.46 68.57,68.2 67.46,67.08 v56.27,67.08
  Top 1: R18.2 R21.2
  Bottom 0.5: v56.27,67.08 56.27,66.03 50.04,59.8 32.29,59.8 30.89,58.41 22.83,58.41 22.13,57.71 22.13,53.7 21.74,53.3 v21.2,53.3
THERM1
  Top 0.2: IC6.5 23.2,55.31 21.05,57.46 21.05,62.6 JP9.2
UART_MCU_RX
  Top 0.5: IC2.17 43,68.6 43,67.8 45.96,64.84 SJ2.2
  Top 1: SJ2.2 78.24,61.8 83,61.8 84.28,60.52 JP7.2
UART_MCU_TX  (via drill 0.3 pad 0.7)
  Top 0.5: IC2.18 44.14,67.55 46.22,65.47 73.37,65.47 v73.6,65.69 | v79.8,65.2 79.44,64.84 SJ1.2
  Top 1: SJ1.2 79.64,63.4 85.2,63.4 86.82,61.78 JP7.3
  Bottom 0.5: v73.6,65.69 79.31,65.69 v79.8,65.2
USIM_CLK  (via drill 0.35)
  Top 0.5: IC2.13 36.45,70.6 v35.4,70.6 | v25,72.8 R6.1
  Bottom 0.5: v35.4,70.6 27.2,70.6 v25,72.8
USIM_DATA  (via drill 0.35)
  Top 0.5: IC2.11 31.56,72.84 v29.4,75 R7.1 | R4.2 v16.2,74.6
  Bottom 0.5: v16.2,74.6 17,73.8 28.2,73.8 v29.4,75
USIM_GND
  Top 0.5: J2.C5 18.5,81.69 16.88,83.32 J2.MP1 11.2,83.25 11.2,81.4 14,78.6 C16.2 | IC2.10 34.86,73.94 33.4,75.4 33.4,80 30,83.4 28.81,83.4 J2.MP2
  Top 1: J2.MP1 J2.MP3 J2.MP4 J2.MP2
USIM_RST
  Top 0.5: IC2.12 23.06,71.74 20.6,74.2 R5.1
USIM_VDD
  Top 0.3: IC3.3 10.35,77.95 10.35,78.37 11.52,79.54 12.27,79.54 12.71,79.1 12.71,77.44 C16.1
  Top 0.5: J2.C1 17.23,79.64 16.2,78.6 R4.1 | R4.1 C6.1 18.75,77.85 19.6,77 19.6,74.31 24.12,69.79 38.59,69.79 IC2.14 | C16.1 14.05,76.2 14.6,76.2 15,76.6 15,77.4 15.45,77.85 R4.1
VBAT  (via drill 0.4 pad 0.3, 0.5 pad 0.7)
  Top 0.2: C23.1 28.25,51.8 IC6.16 26.2,51.2 26,51 25.4,51 IC6.15 | IC6.15 IC6.14 | IC6.15 v25.2,49.8
  Top 0.5: C23.1 30.05,51.95 33.2,48.8 35.52,48.8 SJ5.1
  Top 1: SJ5.1 35.6,45.6 36.4,44.8 v49,44.8
  Bottom 0.5: R31.1 62.25,33.25 67.03,38.03 Q3.3 67.03,39.84 68.4,41.2 69.2,41.2 R14.2
  Bottom 1: $3_30_$_2023-03-21_17-43-41.1 15.9,30.8 D5.1 25.2,38.2 v25.2,49.8 | v49,44.8 65.6,44.8 69.2,41.2
VBUS1
  Top 0.6: 14.41,7.61 14.02,8 13,8 12.71,8.29 D4.2 10.89,8.95 SJ4.1 | $3_29_$_2023-03-21_17-43-41.VBUS1 14.41,5.39 14.8,5 17,5 17.41,5.41 $3_29_$_2023-03-21_17-43-41.VBUS2
  Top 0.7: $3_29_$_2023-03-21_17-43-41.VBUS1 14.41,7.61 14.8,8 D2.1
VDD33  (via drill 0.3 pad 0.3, 0.35, 0.6 pad 1)
  Top 0.5: IC7.5 43.05,49.35 C24.1 | R1.2 v91,52.4 | v60.4,52.2 60.45,52.25 R3.2
  Top 1: IC2.42 IC2.43 40.8,85.88 C9.1 C11.1 C13.1 49.35,89.35 50,90 49,91 v48,91 | IC1.2 C5.2 C4.2 63.75,88.05 C2.+ | C24.1 43.22,50.57 43.22,50.81 44.2,51.79 C26.+ | C2.+ 60.8,91 v60,91 | C2.+ 62,91 v63,91 | v52,91 50.4,91 C14.+ | R2.2 v82.4,55.2
  Bottom 0.5: IC9.1 59.84,16.45 59.28,16.45 58.56,15.74 58.56,14.26 55.07,10.77 54.16,10.77 52.86,9.47 51.24,9.47 49.95,10.77 J4.4 | Q4.3 54.8,39.48 v54.8,38.2 | R32.1 49.62,32.03 v48.45,32.03
  pour Route2: 0,0 0,97.6 0.2,97.6 100,97.6 100,0
VDD_FAN  (via drill 0.3 pad 0.3)
  Top 0.5: IC8.5 50.05,49.35 C25.1
  Top 1: IC8.5 49.95,47.45 50.04,47.45 50.45,47.04 50.45,27.55 v55.2,22.8
  Bottom 0.5: IC9.3 60.72,14.75
  Bottom 0.7: J5.6 60.72,14.75 | IC9.3 61.55,14.75 62.8,16
  Bottom 1: v55.2,22.8 55.65,22.35 55.65,22.23 56.23,21.65 57.15,21.65 62.8,16
VDD_LED
  Top 0.5: LED1.A 15.15,65.4 11.6,65.4 10.93,64.73 JP11.1
  Top 1: JP11.1 10.15,62.22 LED2.A LED3.A LED4.A
VIN  (via drill 0.3 pad 0.3, 0.3 pad 0.4)
  Top 0.2: IC6.17 IC6.18 IC6.19 v27.18,53.3 | v23.88,55.65 24.2,55.32 IC6.3 IC6.4
  Top 0.5: v23.88,55.65 22.6,56.92 C19.1 24.4,59.75 R15.2 | IC8.1 45.65,48.35 45.15,48.85 C21.1 44.36,49.61 v44.2,49.61
  Top 0.6: SJ4.2 10.89,11.25 D4.1 | SJ3.2 31.04,18.75 D3.1
  Top 1: D4.1 13.5,12.04 13.5,12.89 18.97,18.36 SJ3.2 | D3.1 34.35,45.05 v29,50.4 29,47.66 26.24,44.9 11.06,44.9 8.65,47.31 8.65,63.7 10.93,65.98 JP10.2
  Bottom 0.2: v27.18,53.3 24.83,55.65 v23.88,55.65
  Bottom 0.5: v44.2,49.61 43.41,50.4 v29,50.4
  Bottom 1: v29,50.4 27.18,52.22 v27.18,53.3
VIN_LDO
  Top 0.5: SJ5.2 C22.1 38.15,48.85 | IC7.1 38.65,48.35 38.15,48.85 | IC7.3 38.66,46.45 38.15,46.96 38.15,48.85
VM1
  Bottom 0.5: R10.2 76.95,36.55 78.17,35.33 78.74,35.33 79,35.06 79,34.5 IC4.2
VOL_SENS  (via drill 0.3 pad 0.3)
  Top 0.5: v69.6,30.8 67.8,32.6 v67.8,44.4 | v65.1,70.3 65.96,71.17 65.96,78.83 70.11,82.97 IC1.6
  Bottom 0.5: R33.1 68.95,30.8 v69.6,30.8 | v67.8,44.4 64.4,47.8 62.4,47.8 61.4,48.8 61.4,63.05 65.08,66.72 65.08,70.28 v65.1,70.3
  Bottom 1: R33.1 R34.2 C29.1
VPCC1
  Top 0.2: IC6.2 24.7,57.75 R15.1
  Top 0.5: R15.1 R16.1
(copper drawn outside any net)
  shapes: Top area x1

### Text on the board
tNames: C:/Users/jirka/Downloads/bitmap.bmp | V2 - 03.2023 | JLCJLCJLCJLC